# Altium project OpenIMU.PrjPcb
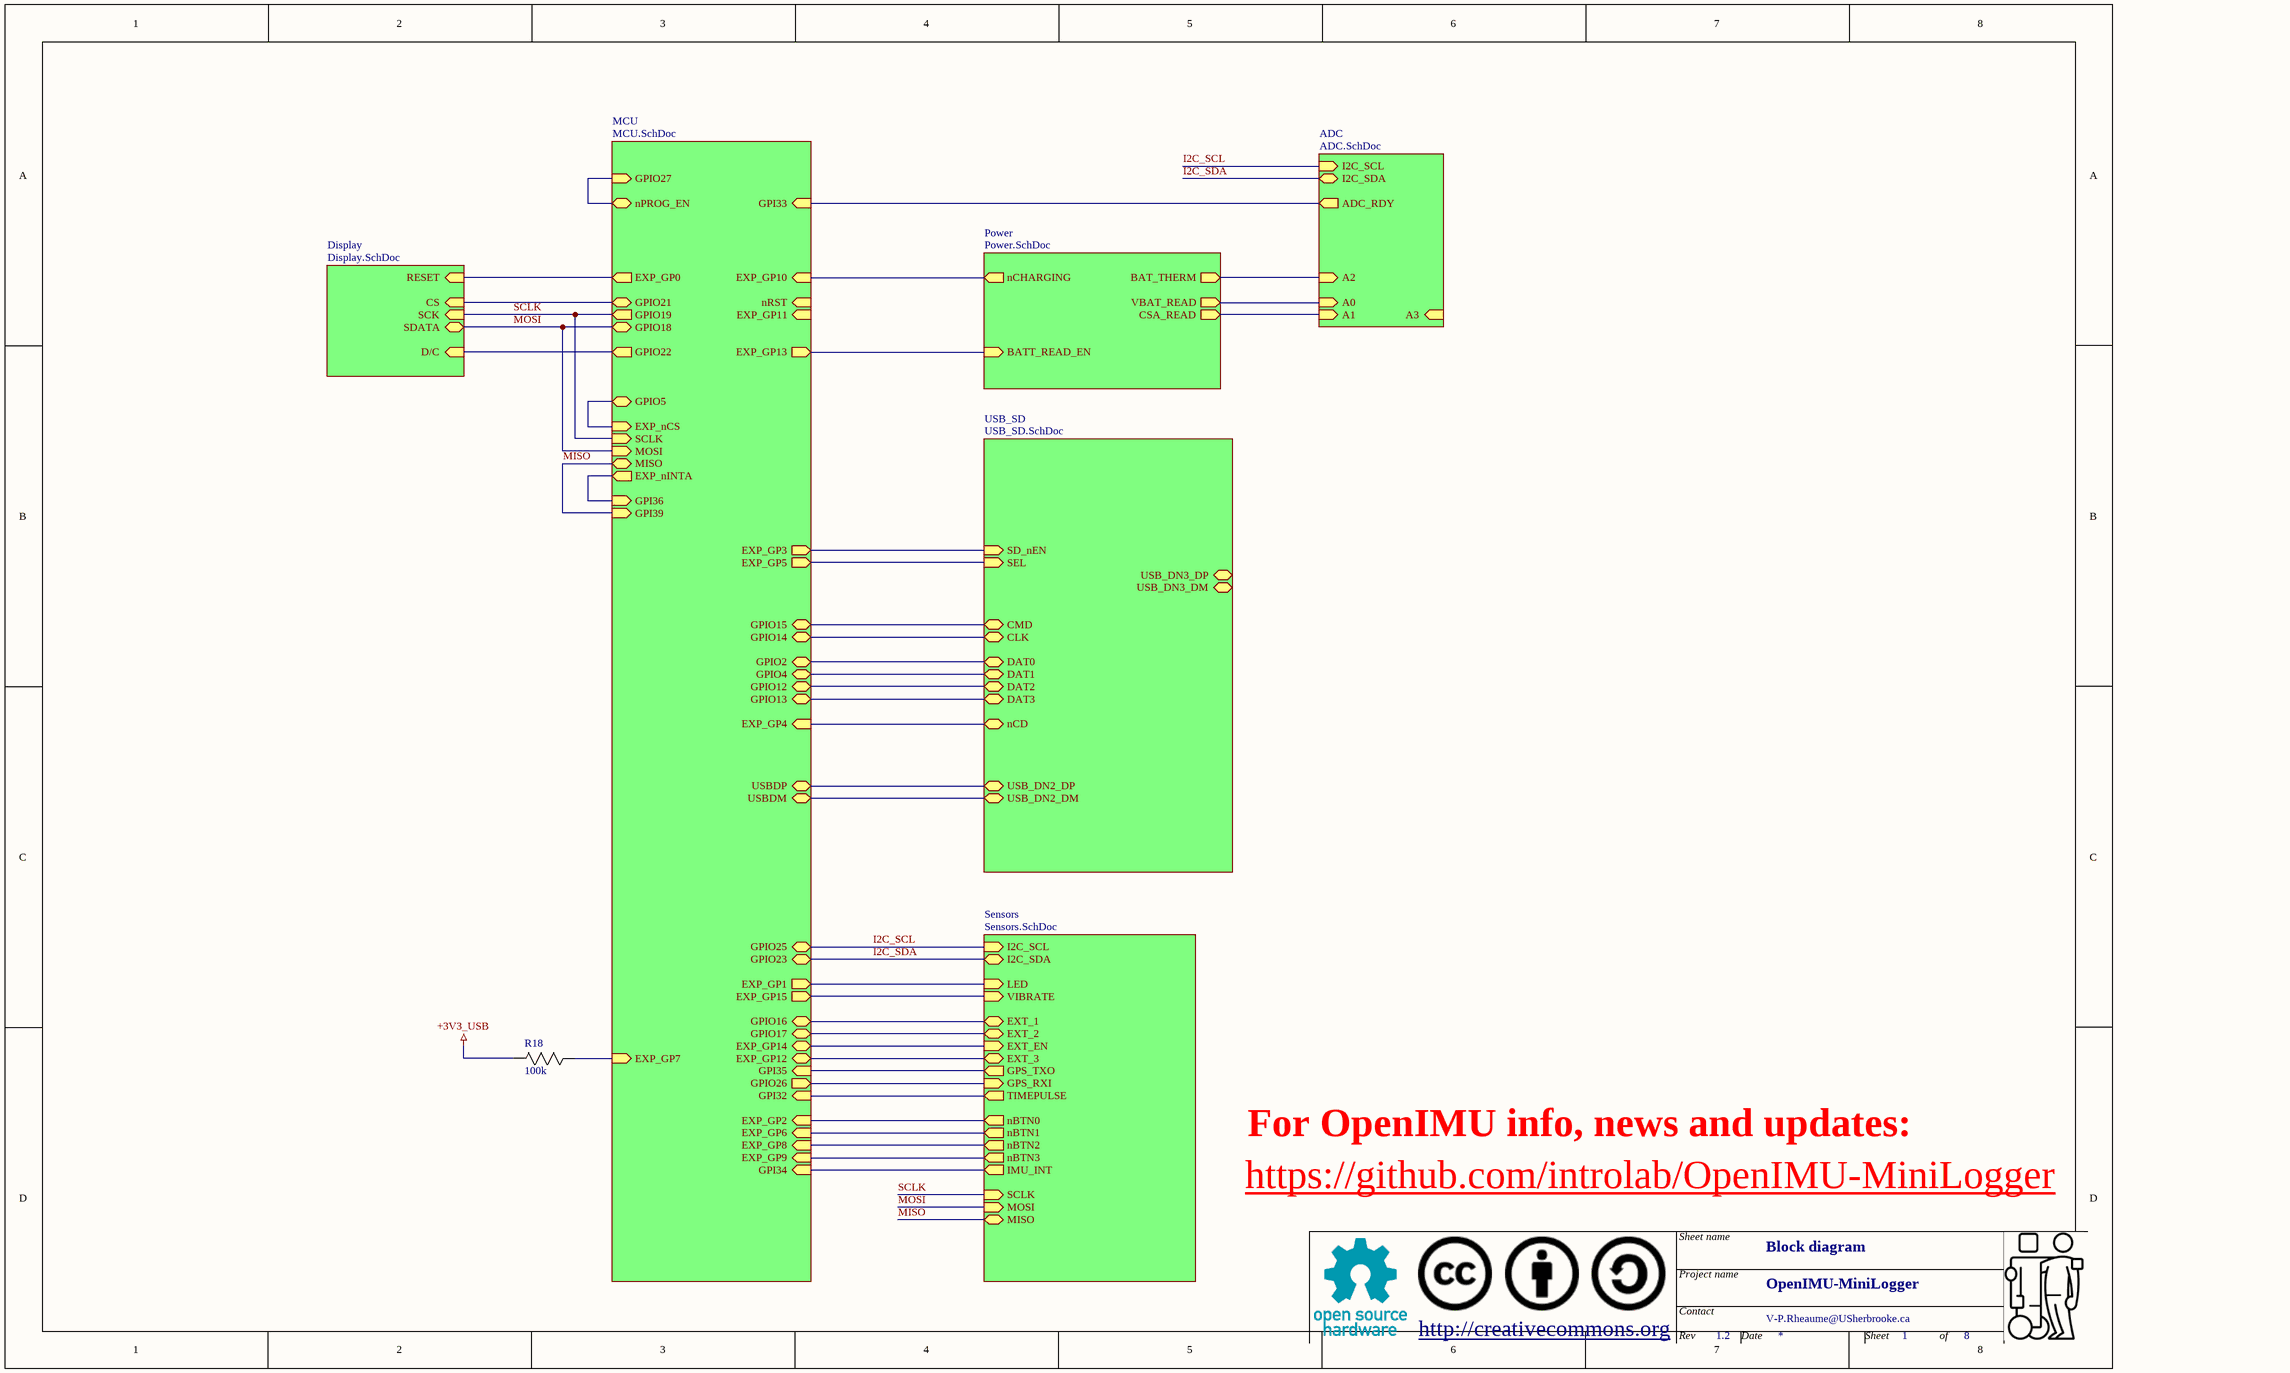
[diagram p0: TopLevel.SchDoc]
RevisionGlobal: 1.2; ProjectTitle: OpenIMU-MiniLogger; DrawnByGlobal: V-P.Rheaume@USherbrooke.ca
8 sheets, 117 parts. Net scope: hierarchical (ports join the sheet entries above them; power ports are global).
Board file: PCB1.PcbDoc
Sheets:
  TopLevel.SchDoc
    USB_SD = USB_SD.SchDoc
      SD_Share = SD_Share.SchDoc
    MCU = MCU.SchDoc
    Power = Power.SchDoc
    Sensors = Sensors.SchDoc
    Display = Display.SchDoc
    ADC = ADC.SchDoc

## Sheet TopLevel.SchDoc
size Tabloid; DrawnBy: V-P.Rheaume@USherbrooke.ca; Organization: Universite de Sherbrooke; Address1: L3, 12a Rodborough Rd; Address2: Frenchs Forest; Address3: NSW; Address4: Australia 2086; Revision: 0; SheetNumber: 1; SheetTotal: 8; SheetName: Block diagram

### Parts
R18  value 100k  [0402]  (hidden comment: Resistor)

### Sub-sheets
ADC = ADC.SchDoc: A2 (in), A3 (in), A1 (in), A0 (in), I2C_SCL (in), ADC_RDY (out), I2C_SDA (bidir)
Display = Display.SchDoc: SDATA (bidir), CS (in), RESET (in), SCK (in), D/C (in)
MCU = MCU.SchDoc: GPIO14 (bidir), GPIO13 (bidir), GPIO4 (bidir), USBDP (bidir), GPIO12 (bidir), USBDM (bidir), GPIO15 (bidir), GPIO2 (bidir), EXP_GP7 (in), EXP_GP3 (out), EXP_GP2 (in), EXP_GP1 (out), EXP_GP0 (out), EXP_GP6 (in), EXP_GP5 (out), EXP_GP4 (in), EXP_GP11 (in), EXP_GP9 (in), EXP_GP14 (bidir), EXP_GP8 (in), EXP_GP13 (out), EXP_GP15 (out), EXP_GP12 (bidir), EXP_GP10 (in), GPIO5 (bidir), GPIO16 (bidir), GPIO17 (bidir), GPIO18 (bidir), GPIO19 (out), GPIO22 (out), GPIO21 (bidir), GPI35 (in), GPIO27 (in), GPIO26 (out), GPIO23 (bidir), GPIO25 (bidir), nRST (in), GPI39 (in), GPI36 (in), GPI34 (in), MOSI (in), EXP_nCS (in), MISO (bidir), SCLK (in), EXP_nINTA (out), GPI33 (in), GPI32 (in), nPROG_EN (bidir)
Power = Power.SchDoc: CSA_READ (out), VBAT_READ (out), BATT_READ_EN (in), BAT_THERM (out), nCHARGING (out)
Sensors = Sensors.SchDoc: TIMEPULSE (out), LED (in), nBTN2 (out), VIBRATE (in), nBTN1 (out), IMU_INT (out), I2C_SDA (bidir), I2C_SCL (in), GPS_RXI (in), GPS_TXO (out), EXT_1 (bidir), EXT_2 (bidir), EXT_EN (in), nBTN3 (out), nBTN0 (out), MISO (bidir), MOSI (in), EXT_3 (bidir), SCLK (in)
USB_SD = USB_SD.SchDoc: SEL (in), CMD (bidir), CLK (bidir), DAT1 (bidir), nCD (bidir), DAT2 (bidir), DAT0 (bidir), USB_DN3_DP (bidir), USB_DN3_DM (bidir), DAT3 (bidir), USB_DN2_DM (bidir), USB_DN2_DP (bidir), SD_nEN (in)

### Nets
+3V3_USB: R18.2
I2C_SCL: sheet MCU/GPIO25, sheet Sensors/I2C_SCL, sheet ADC/I2C_SCL
I2C_SDA: sheet MCU/GPIO23, sheet Sensors/I2C_SDA, sheet ADC/I2C_SDA
MISO: sheet MCU/GPI39, sheet MCU/MISO, sheet Sensors/MISO
MOSI: sheet MCU/GPIO18, sheet MCU/MOSI, sheet Sensors/MOSI, sheet Display/SDATA
SCLK: sheet MCU/GPIO19, sheet MCU/SCLK, sheet Sensors/SCLK, sheet Display/SCK
NetC20_2: sheet Power/VBAT_READ, sheet ADC/A0
NetC23_2: sheet Power/BAT_THERM, sheet ADC/A2
NetC43_2: sheet MCU/EXP_GP13, sheet Power/BATT_READ_EN
NetD2_A: sheet MCU/EXP_GP1, sheet Sensors/LED
NetD3_A: sheet USB_SD/nCD, sheet MCU/EXP_GP4
NetD5_A: sheet MCU/EXP_GP10, sheet Power/nCHARGING
NetP6_6: sheet MCU/GPIO21, sheet Display/CS
NetP6_7: sheet MCU/GPIO22, sheet Display/D/C
NetP6_8: sheet MCU/EXP_GP0, sheet Display/RESET
NetQ1_G: sheet MCU/EXP_GP15, sheet Sensors/VIBRATE
NetQ2_G: sheet USB_SD/SD_nEN, sheet MCU/EXP_GP3
NetQ4_G: sheet USB_SD/SEL, sheet MCU/EXP_GP5
NetQ15_G: sheet MCU/EXP_GP14, sheet Sensors/EXT_EN
NetR2_1: sheet MCU/GPIO26, sheet Sensors/GPS_RXI
NetR3_1: sheet MCU/GPI35, sheet Sensors/GPS_TXO
NetR18_1: R18.1 ; sheet MCU/EXP_GP7
NetR26_1: sheet MCU/GPIO27, sheet MCU/nPROG_EN
NetR32_2: sheet MCU/GPIO17, sheet Sensors/EXT_2
NetR34_2: sheet MCU/GPIO16, sheet Sensors/EXT_1
NetR41_2: sheet MCU/EXP_GP12, sheet Sensors/EXT_3
NetSW2_1: sheet MCU/EXP_GP8, sheet Sensors/nBTN2
NetSW3_1: sheet MCU/EXP_GP9, sheet Sensors/nBTN3
NetSW4_1: sheet MCU/EXP_GP6, sheet Sensors/nBTN1
NetSW5_1: sheet MCU/EXP_GP2, sheet Sensors/nBTN0
NetU3_12: sheet USB_SD/DAT1, sheet MCU/GPIO4
NetU3_13: sheet USB_SD/DAT0, sheet MCU/GPIO2
NetU3_14: sheet USB_SD/CLK, sheet MCU/GPIO14
NetU3_16: sheet USB_SD/CMD, sheet MCU/GPIO15
NetU3_17: sheet USB_SD/DAT3, sheet MCU/GPIO13
NetU3_18: sheet USB_SD/DAT2, sheet MCU/GPIO12
NetU4_4: sheet MCU/GPI36, sheet MCU/EXP_nINTA
NetU4_6: sheet MCU/GPI34, sheet Sensors/IMU_INT
NetU4_8: sheet MCU/GPI32, sheet Sensors/TIMEPULSE
NetU4_9: sheet MCU/GPI33, sheet ADC/ADC_RDY
NetU4_29: sheet MCU/GPIO5, sheet MCU/EXP_nCS
NetU6_1: sheet USB_SD/USB_DN2_DM, sheet MCU/USBDM
NetU6_2: sheet USB_SD/USB_DN2_DP, sheet MCU/USBDP
NetU13_5: sheet Power/CSA_READ, sheet ADC/A1

### Notes on the sheet
- For OpenIMU info, news and updates:
- https://github.com/introlab/OpenIMU-MiniLogger
- Sheet name
- http://creativecommons.org
- Project name
- Contact
- Rev
- Date
- Sheet
- of

### Library data of the parts
R18 = Resistor: Mfg: Yageo; Mfg_PN: RC0402JR-07100KL; HelpURL: *; NI: *; Supplier1: Digikey; Supplier1_PN: 311-100KJRCT-ND; Type: *; Rating: *; Tolerance: *

## Sheet USB_SD.SchDoc
size Tabloid; DrawnBy: V-P.Rheaume@USherbrooke.ca; Organization: Universite de Sherbrooke; Address1: L3, 12a Rodborough Rd; Address2: Frenchs Forest; Address3: NSW; Address4: Australia 2086; Revision: 0; SheetNumber: 4; SheetTotal: 8; SheetName: USB hub
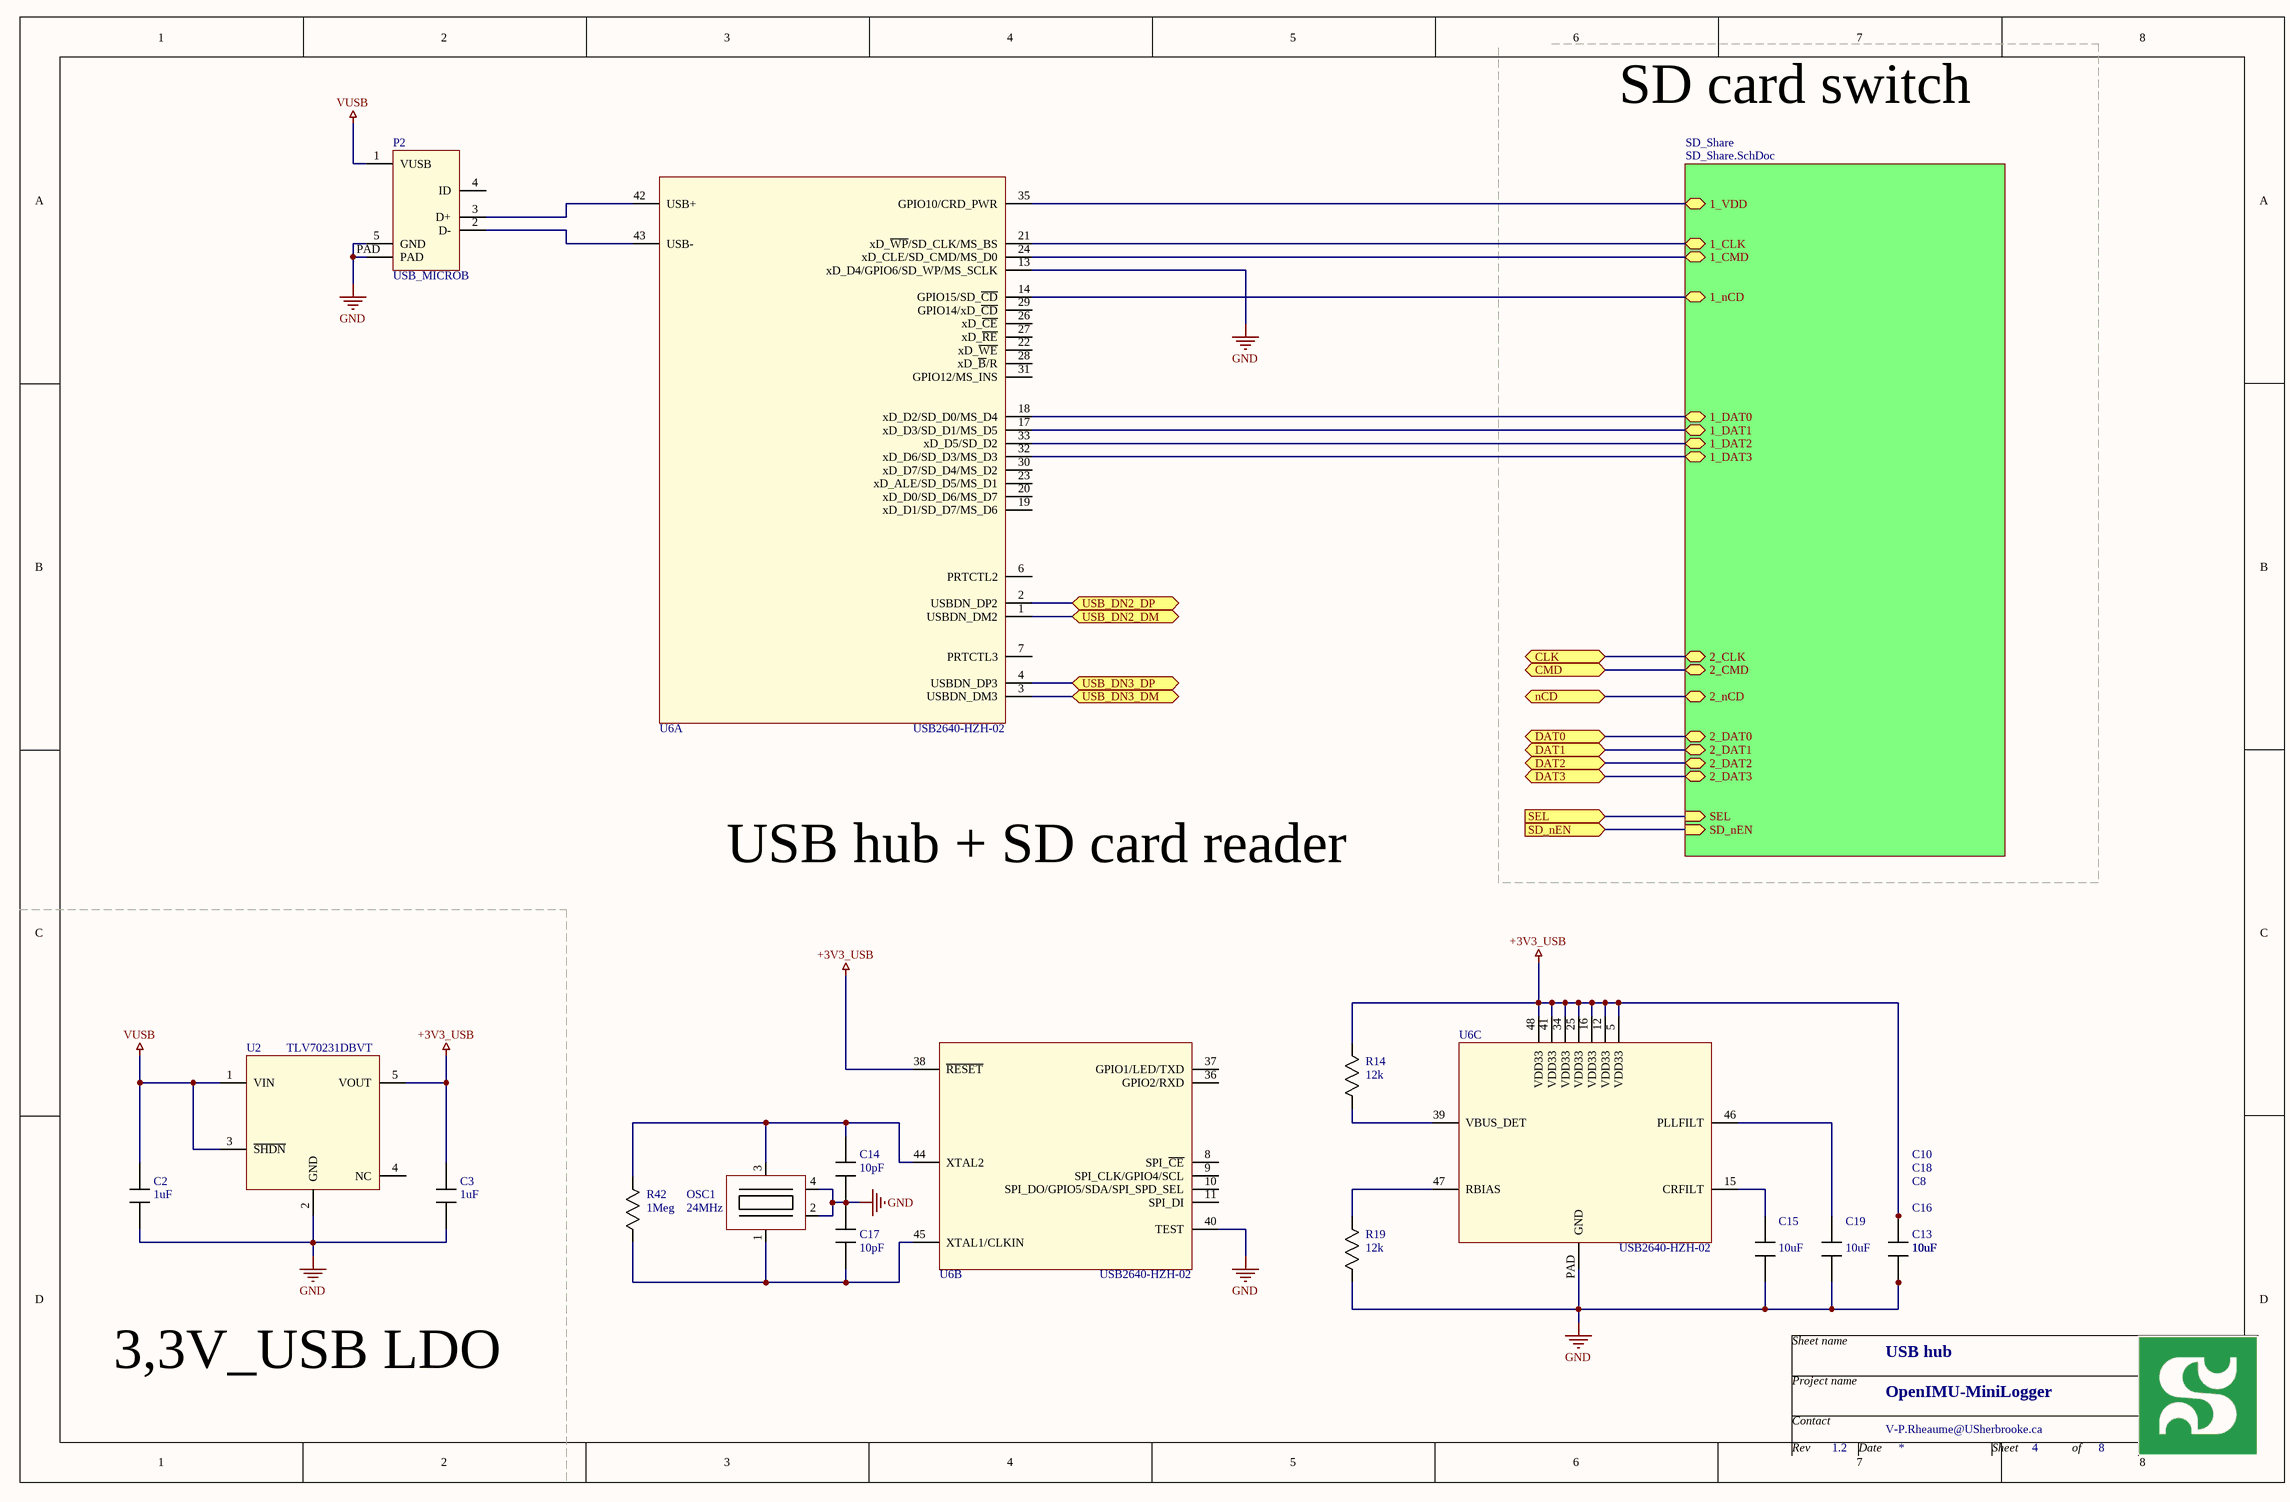
[diagram p1: USB_SD.SchDoc]

### Parts
C2  value 1uF  [0603]  (hidden comment: Capacitor)
C3  value 1uF  [0603]  (hidden comment: Capacitor)
C8  value 10uF  [0603]  (hidden comment: Capacitor)
C10  value 10uF  [0603]  (hidden comment: Capacitor)
C13  value 10uF  [0603]  (hidden comment: Capacitor)
C14  value 10pF  [0402]  (hidden comment: Capacitor)
C15  value 10uF  [0603]  (hidden comment: Capacitor)
C16  value 10uF  [0603]  (hidden comment: Capacitor)
C17  value 10pF  [0402]  (hidden comment: Capacitor)
C18  value 10uF  [0603]  (hidden comment: Capacitor)
C19  value 10uF  [0603]  (hidden comment: Capacitor)
OSC1  value 24MHz  [XTAL_ABM10]  (hidden comment: Crystal_4)
P2  USB_MICROB  [USB_MICROB]
R14  value 12k  [0402]  (hidden comment: Resistor)
R19  value 12k  [0402]  (hidden comment: Resistor)
R42  value 1Meg  [0603]  (hidden comment: Resistor)
U2  Mfg_PN: TLV70231DBVT  [SOT23_5]  (hidden comment: AP2112K-3.3TRG1)
U6  USB2640-HZH-02  [QFN48]  (parts A,B,C of 3)

### Sub-sheets
SD_Share = SD_Share.SchDoc: 2_DAT0 (bidir), 2_DAT1 (bidir), 1_nCD (bidir), 1_VDD (bidir), 2_nCD (bidir), SEL (in), 2_DAT3 (bidir), 1_DAT2 (bidir), 1_DAT1 (bidir), 1_CLK (bidir), 1_CMD (bidir), 2_CMD (bidir), 2_DAT2 (bidir), 1_DAT0 (bidir), 2_CLK (bidir), 1_DAT3 (bidir), SD_nEN (in)

### Ports
CLK (bidir), CMD (bidir), DAT0 (bidir), DAT1 (bidir), DAT2 (bidir), DAT3 (bidir), nCD (bidir), SD_nEN (in), SEL (in), USB_DN2_DM (bidir), USB_DN2_DP (bidir), USB_DN3_DM (bidir), USB_DN3_DP (bidir)

### Nets
+3V3_USB: C3.1 C8.1 C10.1 C13.1 C16.1 C18.1 R14.1 U2.5(VOUT) U6.5(VDD33) U6.12(VDD33) U6.16(VDD33) U6.25(VDD33) U6.34(VDD33) U6.38(~{RESET}) U6.41(VDD33) U6.48(VDD33)
GND: C2.2 C3.2 C8.2 C10.2 C13.2 C14.2 C15.2 C16.2 C17.1 C18.2 C19.2 OSC1.2 OSC1.4 P2.5(GND) P2.PAD R19.2 U2.2(GND) U6.13(xD_D4/GPIO6/SD_WP/MS_SCLK) U6.40(TEST) U6.PAD(GND)
VUSB: C2.1 P2.1(VUSB) U2.1(VIN) U2.3(~{SHDN})
1_VDD: U6.35(GPIO10/CRD_PWR) ; sheet SD_Share/1_VDD
NetC14_1: C14.1 OSC1.3 R42.1 U6.44(XTAL2)
NetC15_1: C15.1 U6.15(CRFILT)
NetC17_2: C17.2 OSC1.1 R42.2 U6.45(XTAL1/CLKIN)
NetC19_1: C19.1 U6.46(PLLFILT)
NetD3_A: port nCD, sheet SD_Share/2_nCD
NetD4_A: U6.14(GPIO15/SD_~{CD}) ; sheet SD_Share/1_nCD
NetP2_2: P2.2(D-) U6.43(USB-)
NetP2_3: P2.3(D+) U6.42(USB+)
NetQ2_G: port SD_nEN, sheet SD_Share/SD_nEN
NetQ4_G: port SEL, sheet SD_Share/SEL
NetR14_2: R14.2 U6.39(VBUS_DET)
NetR19_1: R19.1 U6.47(RBIAS)
NetU3_1: U6.33(xD_D5/SD_D2) ; sheet SD_Share/1_DAT2
NetU3_12: port DAT1, sheet SD_Share/2_DAT1
NetU3_13: port DAT0, sheet SD_Share/2_DAT0
NetU3_14: port CLK, sheet SD_Share/2_CLK
NetU3_16: port CMD, sheet SD_Share/2_CMD
NetU3_17: port DAT3, sheet SD_Share/2_DAT3
NetU3_18: port DAT2, sheet SD_Share/2_DAT2
NetU3_19: U6.17(xD_D3/SD_D1/MS_D5) ; sheet SD_Share/1_DAT1
NetU3_20: U6.18(xD_D2/SD_D0/MS_D4) ; sheet SD_Share/1_DAT0
NetU3_21: U6.21(xD_~{WP}/SD_CLK/MS_BS) ; sheet SD_Share/1_CLK
NetU3_23: U6.24(xD_CLE/SD_CMD/MS_D0) ; sheet SD_Share/1_CMD
NetU3_24: U6.32(xD_D6/SD_D3/MS_D3) ; sheet SD_Share/1_DAT3
NetU6_1: U6.1(USBDN_DM2) ; port USB_DN2_DM
NetU6_2: U6.2(USBDN_DP2) ; port USB_DN2_DP
NetU6_3: U6.3(USBDN_DM3) ; port USB_DN3_DM
NetU6_4: U6.4(USBDN_DP3) ; port USB_DN3_DP

Not connected (* = marked no-connect by the designer): P2 4(ID); U2 4(NC); U6 6(PRTCTL2) 7(PRTCTL3) 8(SPI_~{CE}) 9(SPI_CLK/GPIO4/SCL) 10(SPI_DO/GPIO5/SDA/SPI_SPD_SEL) 11(SPI_DI) 19(xD_D1/SD_D7/MS_D6) 20(xD_D0/SD_D6/MS_D7) 22(xD_~{WE}) 23(xD_ALE/SD_D5/MS_D1) 26(xD_~{CE}) 27(xD_~{RE}) 28(xD_~{B}/R) 29(GPIO14/xD_~{CD}) 30(xD_D7/SD_D4/MS_D2) 31(GPIO12/MS_INS) 36(GPIO2/RXD) 37(GPIO1/LED/TXD)

### Notes on the sheet
- SD card switch
- USB hub + SD card reader
- 3,3V_USB LDO
- Sheet name
- Project name
- Contact
- Rev
- Date
- Sheet
- of

### Library data of the parts
C2 C3 = Capacitor: Mfg: Samsung; Mfg_PN: CL10A105KP8NNNC; HelpURL: *; NI: *; Supplier1: Digikey; Supplier1_PN: 1276-1182-1-ND; Tolerance: *; Type: *; Rating: *
C8 C10 C13 C15 C16 C18 C19 = Capacitor: Mfg: Murata; Mfg_PN: GRM188R60J106ME47D; HelpURL: *; NI: *; Supplier1: Digikey; Supplier1_PN: 490-3896-1-ND; Tolerance: *; Type: *; Rating: *
C14 C17 = Capacitor: Mfg: Wurth; Mfg_PN: 885012005007; HelpURL: *; NI: *; Supplier1: Digikey; Supplier1_PN: 732-7425-1-ND; Tolerance: *; Type: *; Rating: *
OSC1 = Crystal_4: Crystal; Mfg: Abracon; Mfg_PN: ABM10-24.000MHZ-E20-T; HelpURL: *; NI: *; Rating: *; Supplier1: Digikey; Supplier1_PN: 535-9093-1-ND; Tolerance: *; Type: *
P2 = USB_MICROB: Micro-B USB connector; Mfg: Amphenol; Mfg_PN: 10118193-0001LF; HelpURL: http://portal.fciconnect.com/Comergent//fci/drawing/10118193.pdf; NI: *; Rating: *; Supplier1: Digikey; Supplier1_PN: 609-4616-1-ND; Tolerance: *; Type: *; Value: *
R14 R19 = Resistor: Mfg: Yageo; Mfg_PN: RC0402JR-0712KL; HelpURL: *; NI: *; Supplier1: Digikey; Supplier1_PN: 311-12KJRCT-ND; Type: *; Rating: *; Tolerance: *
R42 = Resistor: Mfg: Stackpole; Mfg_PN: RMCF0603JG1M00; HelpURL: *; NI: *; Supplier1: Digikey; Supplier1_PN: RMCF0603JG1M00CT-ND; Type: *; Rating: *; Tolerance: *
U2 = AP2112K-3.3TRG1: Linear voltage regulator; Mfg: TI; HelpURL: *; NI: *; Supplier1: Digikey; Supplier1_PN: 296-27894-1-ND; Type: *
U6 = USB2640-HZH-02: USB2 hub and card reader; Mfg: Microchip; HelpURL: *; NI: *; Rating: *; Supplier1: Digikey; Supplier1_PN: USB2640-HZH-02-ND; Tolerance: *; Type: *; Value: *; Mfg_PN: USB2640-HZH-02

## Sheet SD_Share.SchDoc
size Tabloid; DrawnBy: V-P.Rheaume@USherbrooke.ca; Organization: Universite de Sherbrooke; Address1: L3, 12a Rodborough Rd; Address2: Frenchs Forest; Address3: NSW; Address4: Australia 2086; Revision: 0; SheetNumber: 5; SheetTotal: 8; SheetName: SD Card Sharing
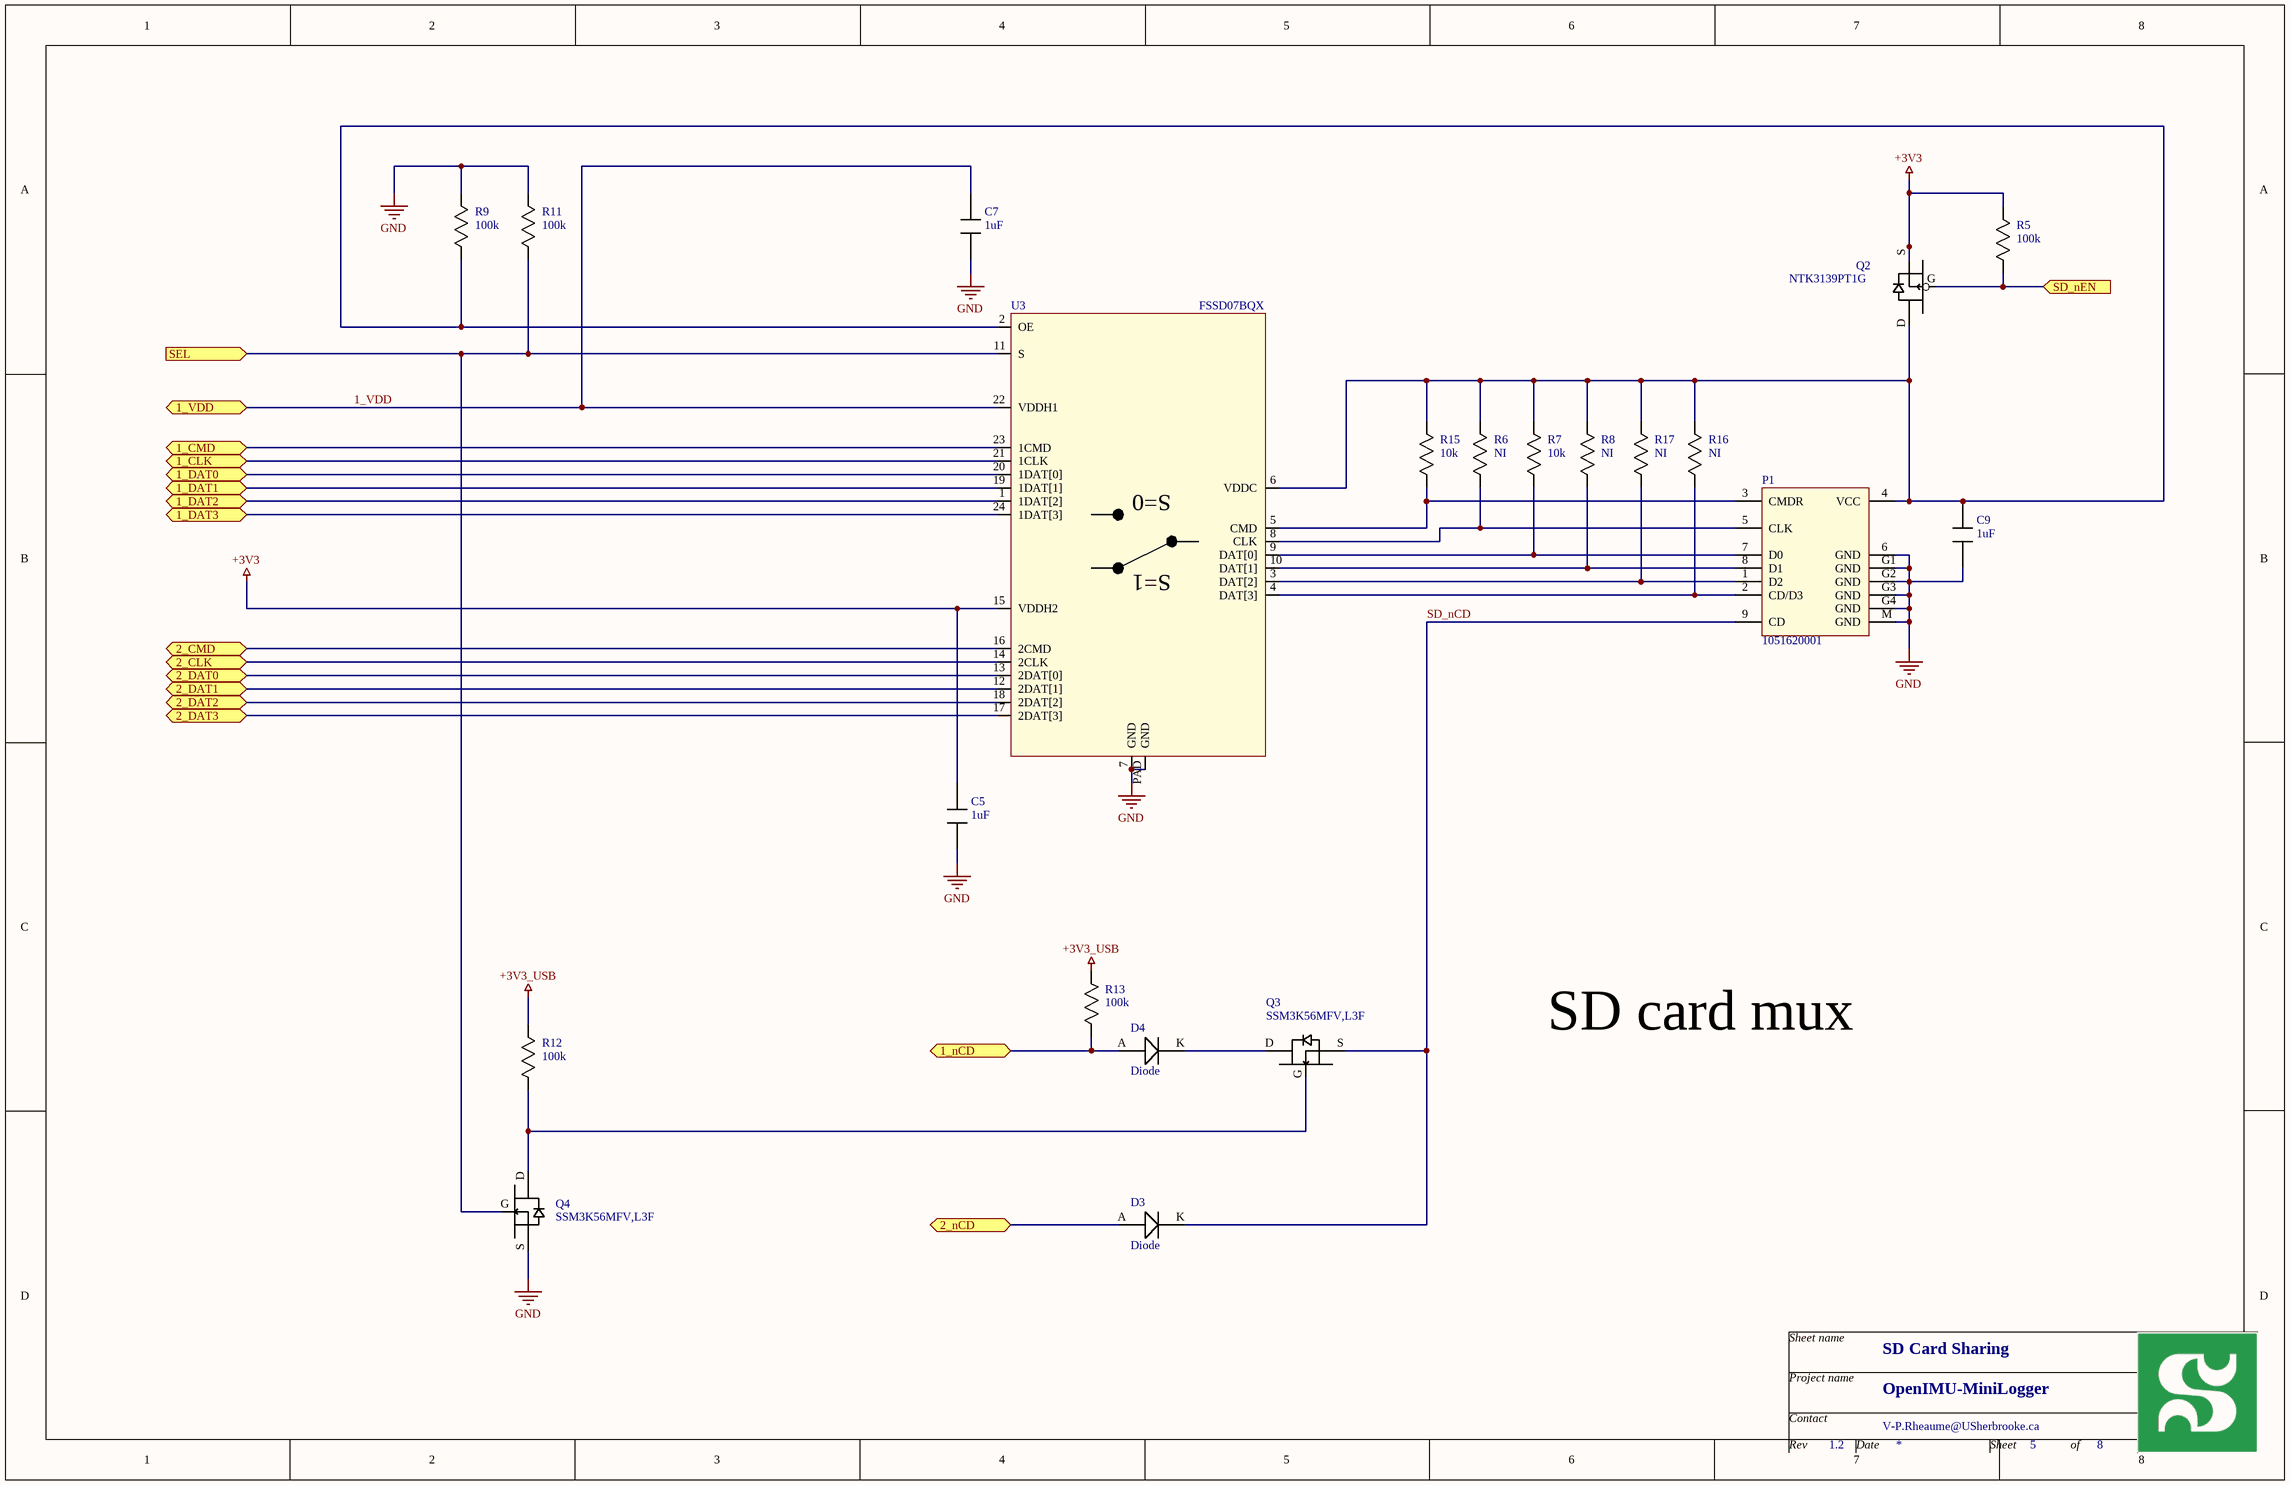
[diagram p2: SD_Share.SchDoc]

### Parts
C5  value 1uF  [0603]  (hidden comment: Capacitor)
C7  value 1uF  [0603]  (hidden comment: Capacitor)
C9  value 1uF  [0603]  (hidden comment: Capacitor)
D3  Diode  [DIODE_SOD523]
D4  Diode  [DIODE_SOD523]
P1  Mfg_PN: 1051620001  [CONN_uSD_MOLEX_1051620001]  (hidden comment: CON_uSD_1051620001)
Q2  Mfg_PN: NTK3139PT1G  [SOT723]  (hidden comment: MOSFET_P_GDS)
Q3  Mfg_PN: SSM3K56MFV,L3F  [SOT723]  (hidden comment: MOSFET_N_GDS)
Q4  Mfg_PN: SSM3K56MFV,L3F  [SOT723]  (hidden comment: MOSFET_N_GDS)
R5  value 100k  [0402]  (hidden comment: Resistor)
R6  Resistor  [0402]  (value not drawn)
R7  value 10k  [0402]  (hidden comment: Resistor)
R8  Resistor  [0402]  (value not drawn)
R9  value 100k  [0402]  (hidden comment: Resistor)
R11  value 100k  [0402]  (hidden comment: Resistor)
R12  value 100k  [0402]  (hidden comment: Resistor)
R13  value 100k  [0402]  (hidden comment: Resistor)
R15  value 10k  [0402]  (hidden comment: Resistor)
R16  Resistor  [0402]  (value not drawn)
R17  Resistor  [0402]  (value not drawn)
U3  FSSD07BQX  [MLP24]

### Ports
1_CLK (bidir), 1_CMD (bidir), 1_DAT0 (bidir), 1_DAT1 (bidir), 1_DAT2 (bidir), 1_DAT3 (bidir), 1_nCD (bidir), 1_VDD (bidir), 2_CLK (bidir), 2_CMD (bidir), 2_DAT0 (bidir), 2_DAT1 (bidir), 2_DAT2 (bidir), 2_DAT3 (bidir), 2_nCD (bidir), SD_nEN (in), SEL (in)

### Nets
+3V3: C5.1 Q2.S R5.1 U3.15(VDDH2)
+3V3_USB: R12.1 R13.1
GND: C5.2 C7.2 C9.2 P1.6(GND) P1.G1(GND) P1.G2(GND) P1.G3(GND) P1.G4(GND) P1.M(GND) Q4.S R9.1 R11.1 U3.7(GND) U3.PAD(GND)
1_VDD: C7.1 U3.22(VDDH1) ; port 1_VDD
SD_nCD: D3.K P1.9(CD) Q3.S
NetC9_1: C9.1 P1.4(VCC) Q2.D R6.1 R7.1 R8.1 R9.2 R15.1 R16.1 R17.1 U3.2(OE) U3.6(VDDC)
NetD3_A: D3.A ; port 2_nCD
NetD4_A: D4.A R13.2 ; port 1_nCD
NetD4_K: D4.K Q3.D
NetP1_1: P1.1(D2) R17.2 U3.3(DAT[2])
NetP1_2: P1.2(CD/D3) R16.2 U3.4(DAT[3])
NetP1_3: P1.3(CMDR) R15.2 U3.5(CMD)
NetP1_5: P1.5(CLK) R6.2 U3.8(CLK)
NetP1_7: P1.7(D0) R7.2 U3.9(DAT[0])
NetP1_8: P1.8(D1) R8.2 U3.10(DAT[1])
NetQ2_G: Q2.G R5.2 ; port SD_nEN
NetQ3_G: Q3.G Q4.D R12.2
NetQ4_G: Q4.G R11.2 U3.11(S) ; port SEL
NetU3_1: U3.1(1DAT[2]) ; port 1_DAT2
NetU3_12: U3.12(2DAT[1]) ; port 2_DAT1
NetU3_13: U3.13(2DAT[0]) ; port 2_DAT0
NetU3_14: U3.14(2CLK) ; port 2_CLK
NetU3_16: U3.16(2CMD) ; port 2_CMD
NetU3_17: U3.17(2DAT[3]) ; port 2_DAT3
NetU3_18: U3.18(2DAT[2]) ; port 2_DAT2
NetU3_19: U3.19(1DAT[1]) ; port 1_DAT1
NetU3_20: U3.20(1DAT[0]) ; port 1_DAT0
NetU3_21: U3.21(1CLK) ; port 1_CLK
NetU3_23: U3.23(1CMD) ; port 1_CMD
NetU3_24: U3.24(1DAT[3]) ; port 1_DAT3

### Notes on the sheet
- SD card mux
- Sheet name
- Project name
- Contact
- Rev
- Date
- Sheet
- of
- (in symbol FSSD07BQX) S=0; S=1

### Library data of the parts
C5 C7 C9 = Capacitor: Mfg: Samsung; Mfg_PN: CL10A105KP8NNNC; HelpURL: *; NI: *; Supplier1: Digikey; Supplier1_PN: 1276-1182-1-ND; Tolerance: *; Type: *; Rating: *
D3 D4 = Diode: Mfg: MCC; Mfg_PN: 1N4148X-TP; HelpURL: *; NI: *; Supplier1: Digikey; Supplier1_PN: 1N4148XTPMSCT-ND; Tolerance: *; Type: *; Rating: *; Value: *
P1 = CON_uSD_1051620001: Micro-SD card slot; Mfg: Molex; HelpURL: *; NI: *; Rating: *; Supplier1: Digikey; Supplier1_PN: WM14405CT-ND; Tolerance: *; Type: uSD; Value: *
Q2 = MOSFET_P_GDS: PMOS; Mfg: OnSemi; HelpURL: *; NI: *; Rating: *; Supplier1: Digikey; Supplier1_PN: NTK3139PT1GOSCT-ND; Tolerance: *; Type: *; Value: *
Q3 Q4 = MOSFET_N_GDS: NMOS; Mfg: Toshiba; HelpURL: *; NI: *; Rating: *; Supplier1: Digikey; Supplier1_PN: SSM3K56MFVL3FCT-ND; Tolerance: *; Type: *; Value: *
R5 R9 R11-R13 = Resistor: Mfg: Yageo; Mfg_PN: RC0402JR-07100KL; HelpURL: *; NI: *; Supplier1: Digikey; Supplier1_PN: 311-100KJRCT-ND; Type: *; Rating: *; Tolerance: *
R6 R8 R16 R17 = Resistor: Mfg: Yageo; Mfg_PN: RC0402FR-0710KL; Value: 10k; HelpURL: *; NI: NI; Supplier1: Digikey; Supplier1_PN: 311-10.0KLRCT-ND; Type: *; Rating: *; Tolerance: *
R7 R15 = Resistor: Mfg: Yageo; Mfg_PN: RC0402FR-0710KL; HelpURL: *; NI: *; Supplier1: Digikey; Supplier1_PN: 311-10.0KLRCT-ND; Type: *; Rating: *; Tolerance: *
U3 = FSSD07BQX: SD Card Host multiplexer; Mfg: OnSemi; HelpURL: *; Mfg_PN: FSSD07BQX; NI: *; Supplier1: Digikey; Supplier1_PN: FSSD07BQXCT-ND; Type: *

## Sheet MCU.SchDoc
size Tabloid; DrawnBy: V-P.Rheaume@USherbrooke.ca; Organization: Universite de Sherbrooke; Address1: L3, 12a Rodborough Rd; Address2: Frenchs Forest; Address3: NSW; Address4: Australia 2086; Revision: 0; SheetNumber: 3; SheetTotal: 8; SheetName: Microcontroller
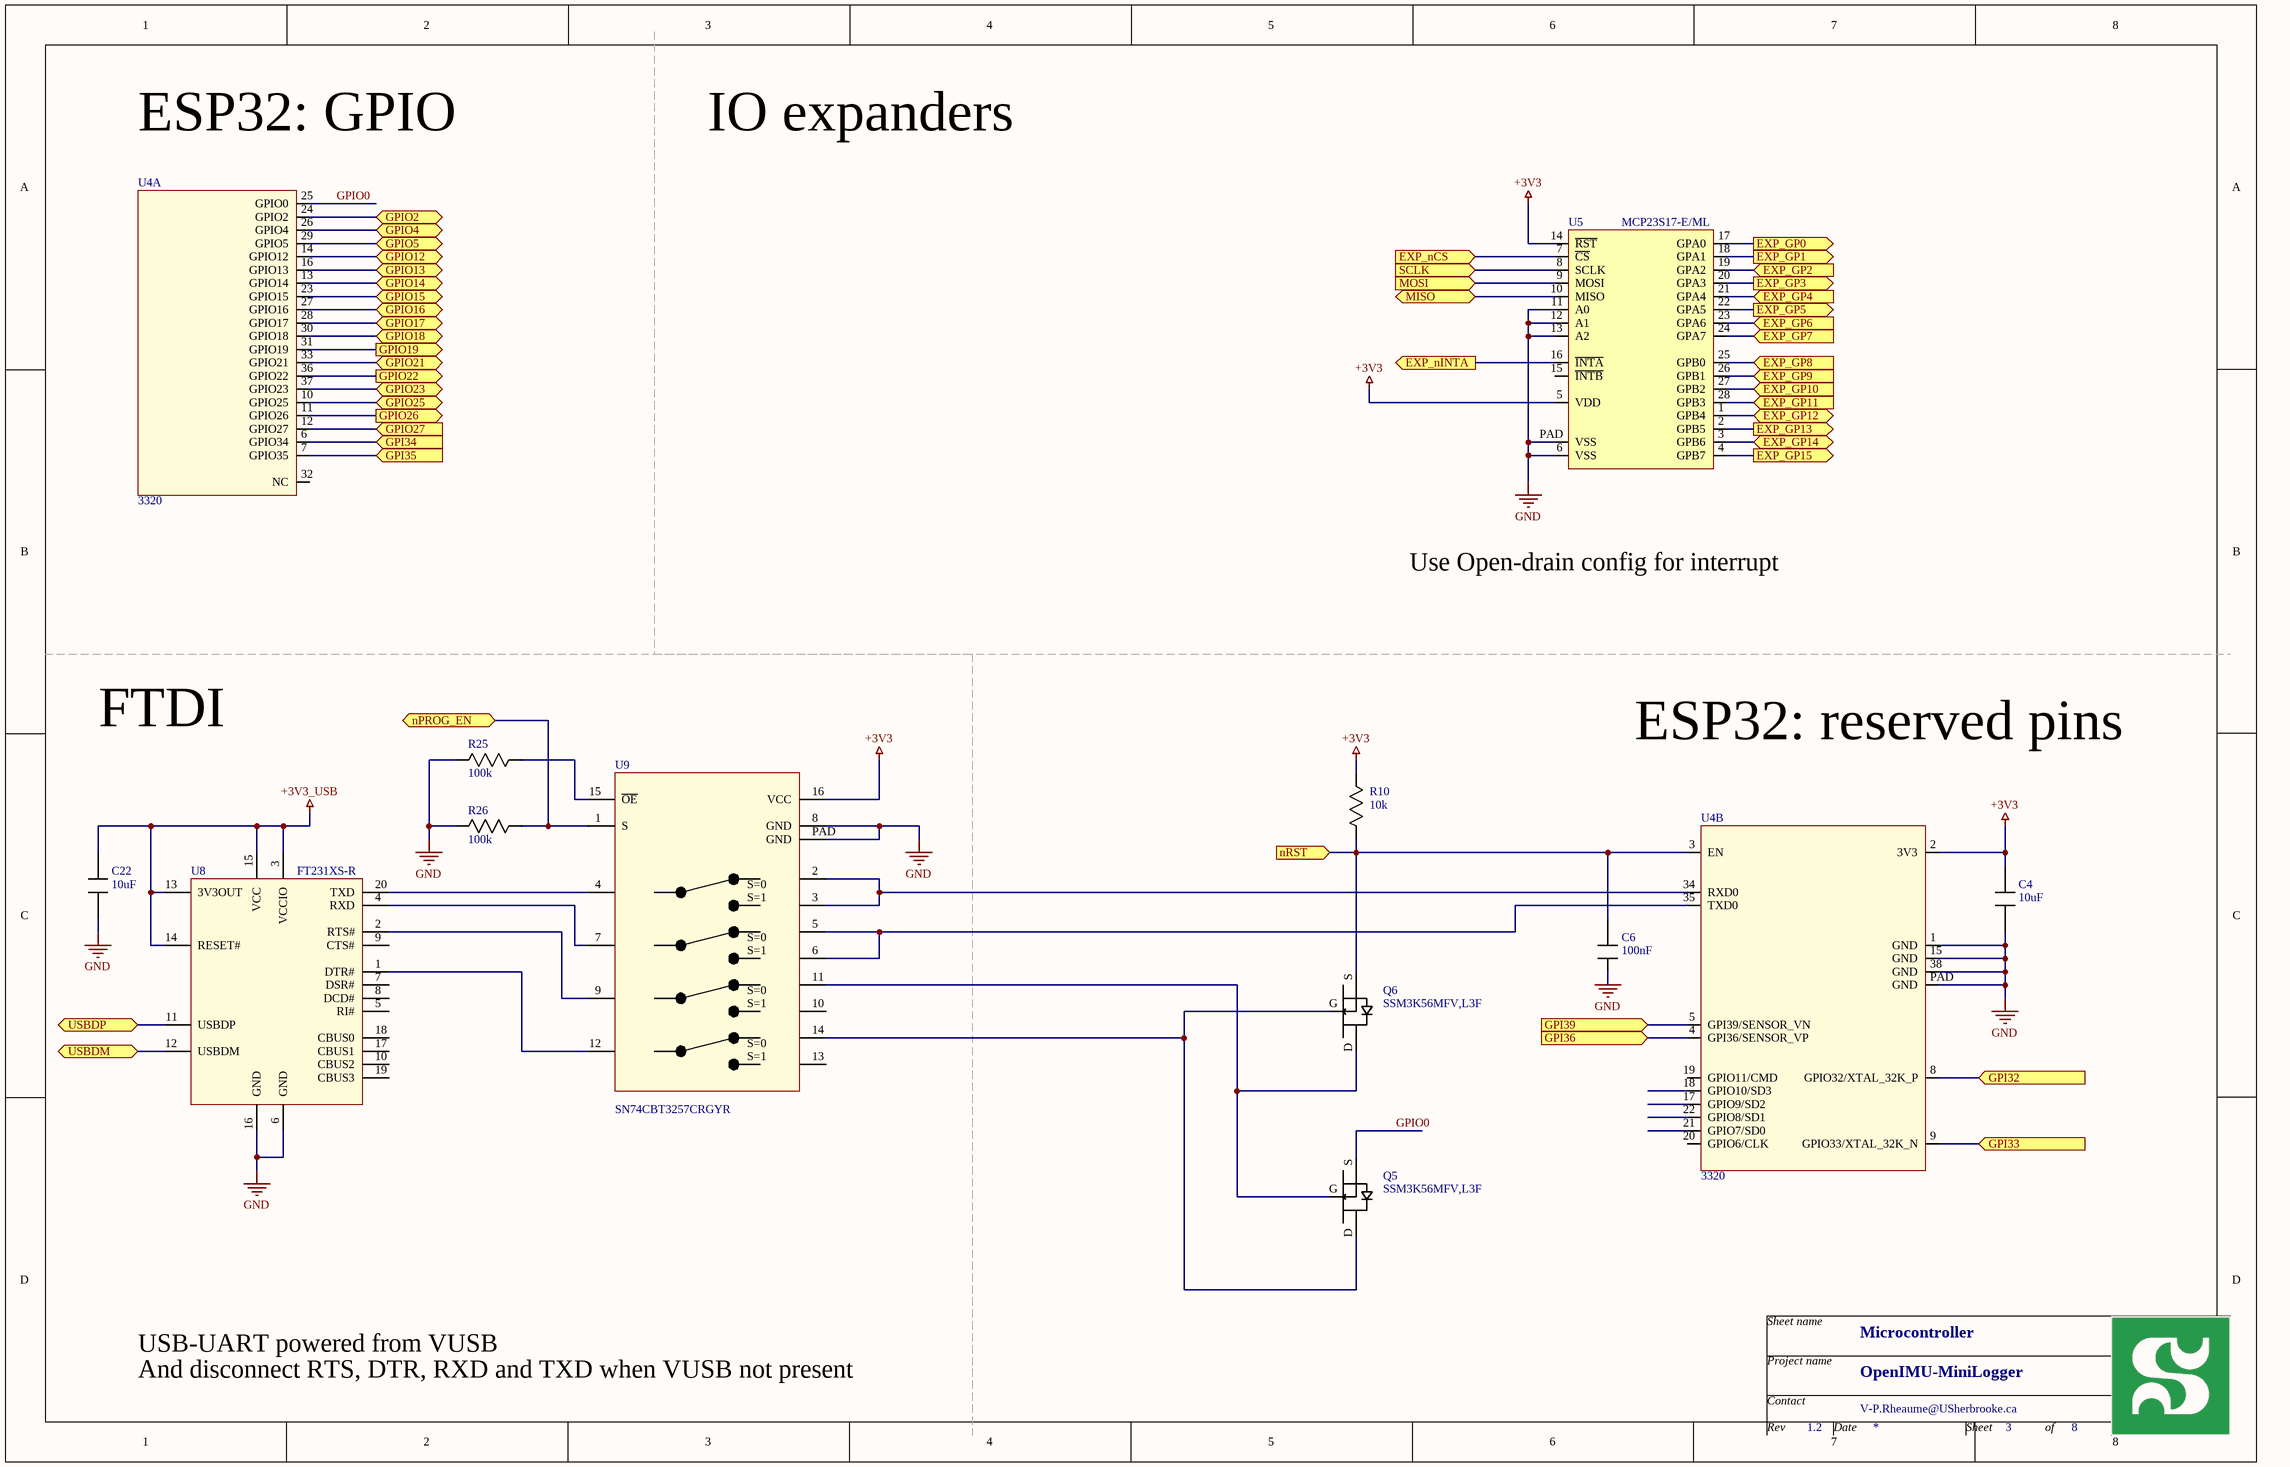
[diagram p3: MCU.SchDoc]

### Parts
C4  value 10uF  [0603]  (hidden comment: Capacitor)
C6  value 100nF  [0603]  (hidden comment: Capacitor)
C22  value 10uF  [0603]  (hidden comment: Capacitor)
Q5  Mfg_PN: SSM3K56MFV,L3F  [SOT723]  (hidden comment: MOSFET_N_GDS)
Q6  Mfg_PN: SSM3K56MFV,L3F  [SOT723]  (hidden comment: MOSFET_N_GDS)
R10  value 10k  [0402]  (hidden comment: Resistor)
R25  value 100k  [0402]  (hidden comment: Resistor)
R26  value 100k  [0402]  (hidden comment: Resistor)
U4  Mfg_PN: 3320  [ESP-WROOM-32]  (hidden comment: ESP-WROOM-32)  (parts A,B of 2)
U5  MCP23S17-E/ML  [QFN28-S]
U8  FT231XS-R  [SSOP20]
U9  SN74CBT3257CRGYR  [QFN16_TI_RGYR]

### Ports
EXP_GP0 (out), EXP_GP1 (out), EXP_GP2 (in), EXP_GP3 (out), EXP_GP4 (in), EXP_GP5 (out), EXP_GP6 (in), EXP_GP7 (in), EXP_GP8 (in), EXP_GP9 (in), EXP_GP10 (in), EXP_GP11 (in), EXP_GP12 (bidir), EXP_GP13 (out), EXP_GP14 (bidir), EXP_GP15 (out), EXP_nCS (in), EXP_nINTA (out), GPI32 (in), GPI33 (in), GPI34 (in), GPI35 (in), GPI36 (in), GPI39 (in), GPIO2 (bidir), GPIO4 (bidir), GPIO5 (bidir), GPIO12 (bidir), GPIO13 (bidir), GPIO14 (bidir), GPIO15 (bidir), GPIO16 (bidir), GPIO17 (bidir), GPIO18 (bidir), GPIO19 (out), GPIO21 (bidir), GPIO22 (out), GPIO23 (bidir), GPIO25 (bidir), GPIO26 (out), GPIO27 (in), MISO (bidir), MOSI (in), nPROG_EN (bidir), nRST (in), SCLK (in), USBDM (bidir), USBDP (bidir)

### Nets
+3V3: C4.2 R10.1 U4.2(3V3) U5.5(VDD) U5.14(~{RST}) U9.16(VCC)
+3V3_USB: C22.2 U8.3(VCCIO) U8.13(3V3OUT) U8.14(RESET#) U8.15(VCC)
GND: C4.1 C6.2 C22.1 R25.2 R26.2 U4.1(GND) U4.15(GND) U4.38(GND) U4.PAD(GND) U5.6(VSS) U5.11(A0) U5.12(A1) U5.13(A2) U5.PAD(VSS) U8.6(GND) U8.16(GND) U9.8(GND) U9.PAD(GND)
GPIO0: Q5.S U4.25(GPIO0)
I2C_SCL: U4.10(GPIO25) ; port GPIO25
I2C_SDA: U4.37(GPIO23) ; port GPIO23
MISO: U4.5(GPI39/SENSOR_VN) U5.10(MISO) ; port GPI39, port MISO
MOSI: U4.30(GPIO18) U5.9(MOSI) ; port GPIO18, port MOSI
SCLK: U4.31(GPIO19) U5.8(SCLK) ; port GPIO19, port SCLK
NetC6_1: C6.1 Q6.S R10.2 U4.3(EN) ; port nRST
NetC43_2: U5.2(GPB5) ; port EXP_GP13
NetD2_A: U5.18(GPA1) ; port EXP_GP1
NetD3_A: U5.21(GPA4) ; port EXP_GP4
NetD5_A: U5.27(GPB2) ; port EXP_GP10
NetP6_6: U4.33(GPIO21) ; port GPIO21
NetP6_7: U4.36(GPIO22) ; port GPIO22
NetP6_8: U5.17(GPA0) ; port EXP_GP0
NetQ1_G: U5.4(GPB7) ; port EXP_GP15
NetQ2_G: U5.20(GPA3) ; port EXP_GP3
NetQ4_G: U5.22(GPA5) ; port EXP_GP5
NetQ5_D: Q5.D Q6.G U9.14(4B1)
NetQ5_G: Q5.G Q6.D U9.11(3B1)
NetQ15_G: U5.3(GPB6) ; port EXP_GP14
NetR2_1: U4.11(GPIO26) ; port GPIO26
NetR3_1: U4.7(GPIO35) ; port GPI35
NetR18_1: U5.24(GPA7) ; port EXP_GP7
NetR25_1: R25.1 U9.15(~{OE})
NetR26_1: R26.1 U4.12(GPIO27) U9.1(S) ; port GPIO27, port nPROG_EN
NetR32_2: U4.28(GPIO17) ; port GPIO17
NetR34_2: U4.27(GPIO16) ; port GPIO16
NetR41_2: U5.1(GPB4) ; port EXP_GP12
NetSW2_1: U5.25(GPB0) ; port EXP_GP8
NetSW3_1: U5.26(GPB1) ; port EXP_GP9
NetSW4_1: U5.23(GPA6) ; port EXP_GP6
NetSW5_1: U5.19(GPA2) ; port EXP_GP2
NetU3_12: U4.26(GPIO4) ; port GPIO4
NetU3_13: U4.24(GPIO2) ; port GPIO2
NetU3_14: U4.13(GPIO14) ; port GPIO14
NetU3_16: U4.23(GPIO15) ; port GPIO15
NetU3_17: U4.16(GPIO13) ; port GPIO13
NetU3_18: U4.14(GPIO12) ; port GPIO12
NetU4_4: U4.4(GPI36/SENSOR_VP) U5.16(~{INTA}) ; port GPI36, port EXP_nINTA
NetU4_6: U4.6(GPIO34) ; port GPI34
NetU4_8: U4.8(GPIO32/XTAL_32K_P) ; port GPI32
NetU4_9: U4.9(GPIO33/XTAL_32K_N) ; port GPI33
NetU4_29: U4.29(GPIO5) U5.7(~{CS}) ; port GPIO5, port EXP_nCS
NetU4_34: U4.34(RXD0) U9.2(1B1) U9.3(1B2)
NetU4_35: U4.35(TXD0) U9.5(2B1) U9.6(2B2)
NetU5_28: U5.28(GPB3) ; port EXP_GP11
NetU6_1: U8.12(USBDM) ; port USBDM
NetU6_2: U8.11(USBDP) ; port USBDP
NetU8_1: U8.1(DTR#) U9.12(4A)
NetU8_2: U8.2(RTS#) U9.9(3A)
NetU8_4: U8.4(RXD) U9.7(2A)
NetU8_20: U8.20(TXD) U9.4(1A)

Not connected (* = marked no-connect by the designer): U4 17(GPIO9/SD2) 18(GPIO10/SD3) 19(GPIO11/CMD) 20(GPIO6/CLK) 21(GPIO7/SD0) 22(GPIO8/SD1) 32(NC); U5 15(~{INTB}); U8 5(RI#) 7(DSR#) 8(DCD#) 9(CTS#) 10(CBUS2) 17(CBUS1) 18(CBUS0) 19(CBUS3); U9 10(3B2) 13(4B2)

### Notes on the sheet
- ESP32: GPIO
- IO expanders
- Use Open-drain config for interrupt
- FTDI
- ESP32: reserved pins
- USB-UART powered from VUSB
- And disconnect RTS, DTR, RXD and TXD when VUSB not present
- Sheet name
- Project name
- Contact
- Rev
- Date
- Sheet
- of
- (in symbol SN74CBT3257CRGYR) S=0; S=1

### Library data of the parts
C4 C22 = Capacitor: Mfg: Murata; Mfg_PN: GRM188R60J106ME47D; HelpURL: *; NI: *; Supplier1: Digikey; Supplier1_PN: 490-3896-1-ND; Tolerance: *; Type: *; Rating: *
C6 = Capacitor: Mfg: Kemet; Mfg_PN: C0603C104Z4VACTU; HelpURL: *; NI: *; Supplier1: Digikey; Supplier1_PN: 399-1098-1-ND; Tolerance: *; Type: *; Rating: *
Q5 Q6 = MOSFET_N_GDS: NMOS; Mfg: Toshiba; HelpURL: *; NI: *; Rating: *; Supplier1: Digikey; Supplier1_PN: SSM3K56MFVL3FCT-ND; Tolerance: *; Type: *; Value: *
R10 = Resistor: Mfg: Yageo; Mfg_PN: RC0402FR-0710KL; HelpURL: *; NI: *; Supplier1: Digikey; Supplier1_PN: 311-10.0KLRCT-ND; Type: *; Rating: *; Tolerance: *
R25 R26 = Resistor: Mfg: Yageo; Mfg_PN: RC0402JR-07100KL; HelpURL: *; NI: *; Supplier1: Digikey; Supplier1_PN: 311-100KJRCT-ND; Type: *; Rating: *; Tolerance: *
U4 = ESP-WROOM-32: ESP32 MCU module with antenna; Mfg: Adafruit; HelpURL: *; NI: *; Rating: *; Supplier1: Digikey; Supplier1_PN: 1528-1801-ND; Tolerance: *; Type: *; Value: *
U5 = MCP23S17-E/ML: 16-Bit SPI I/O Expander; Mfg: Adafruit; Mfg_PN: 3320; Supplier1: Digikey; Supplier1_PN: 1528-1801-ND
U8 = FT231XS-R: USB to serial converter; Mfg: FTDI; HelpURL: *; Mfg_PN: FT231XS-R; NI: *; Rating: *; Supplier1: Digikey; Supplier1_PN: 768-1129-1-ND; Tolerance: *; Type: *; Value: *
U9 = SN74CBT3257CRGYR: Quad 1-of-2 FET switch; Mfg: Texas Instruments; HelpURL: http://www.ti.com/lit/ds/symlink/sn74cbt3257c.pdf; NI: *; Rating: *; Supplier1: Digikey; Supplier1_PN: 296-19212-1-ND; Tolerance: *; Type: *; Value: *; Mfg_PN: SN74CBT3257CRGYR

## Sheet Power.SchDoc
size Tabloid; DrawnBy: V-P.Rheaume@USherbrooke.ca; Organization: Universite de Sherbrooke; Address1: L3, 12a Rodborough Rd; Address2: Frenchs Forest; Address3: NSW; Address4: Australia 2086; Revision: 0; SheetNumber: 2; SheetTotal: 8; SheetName: Battery management
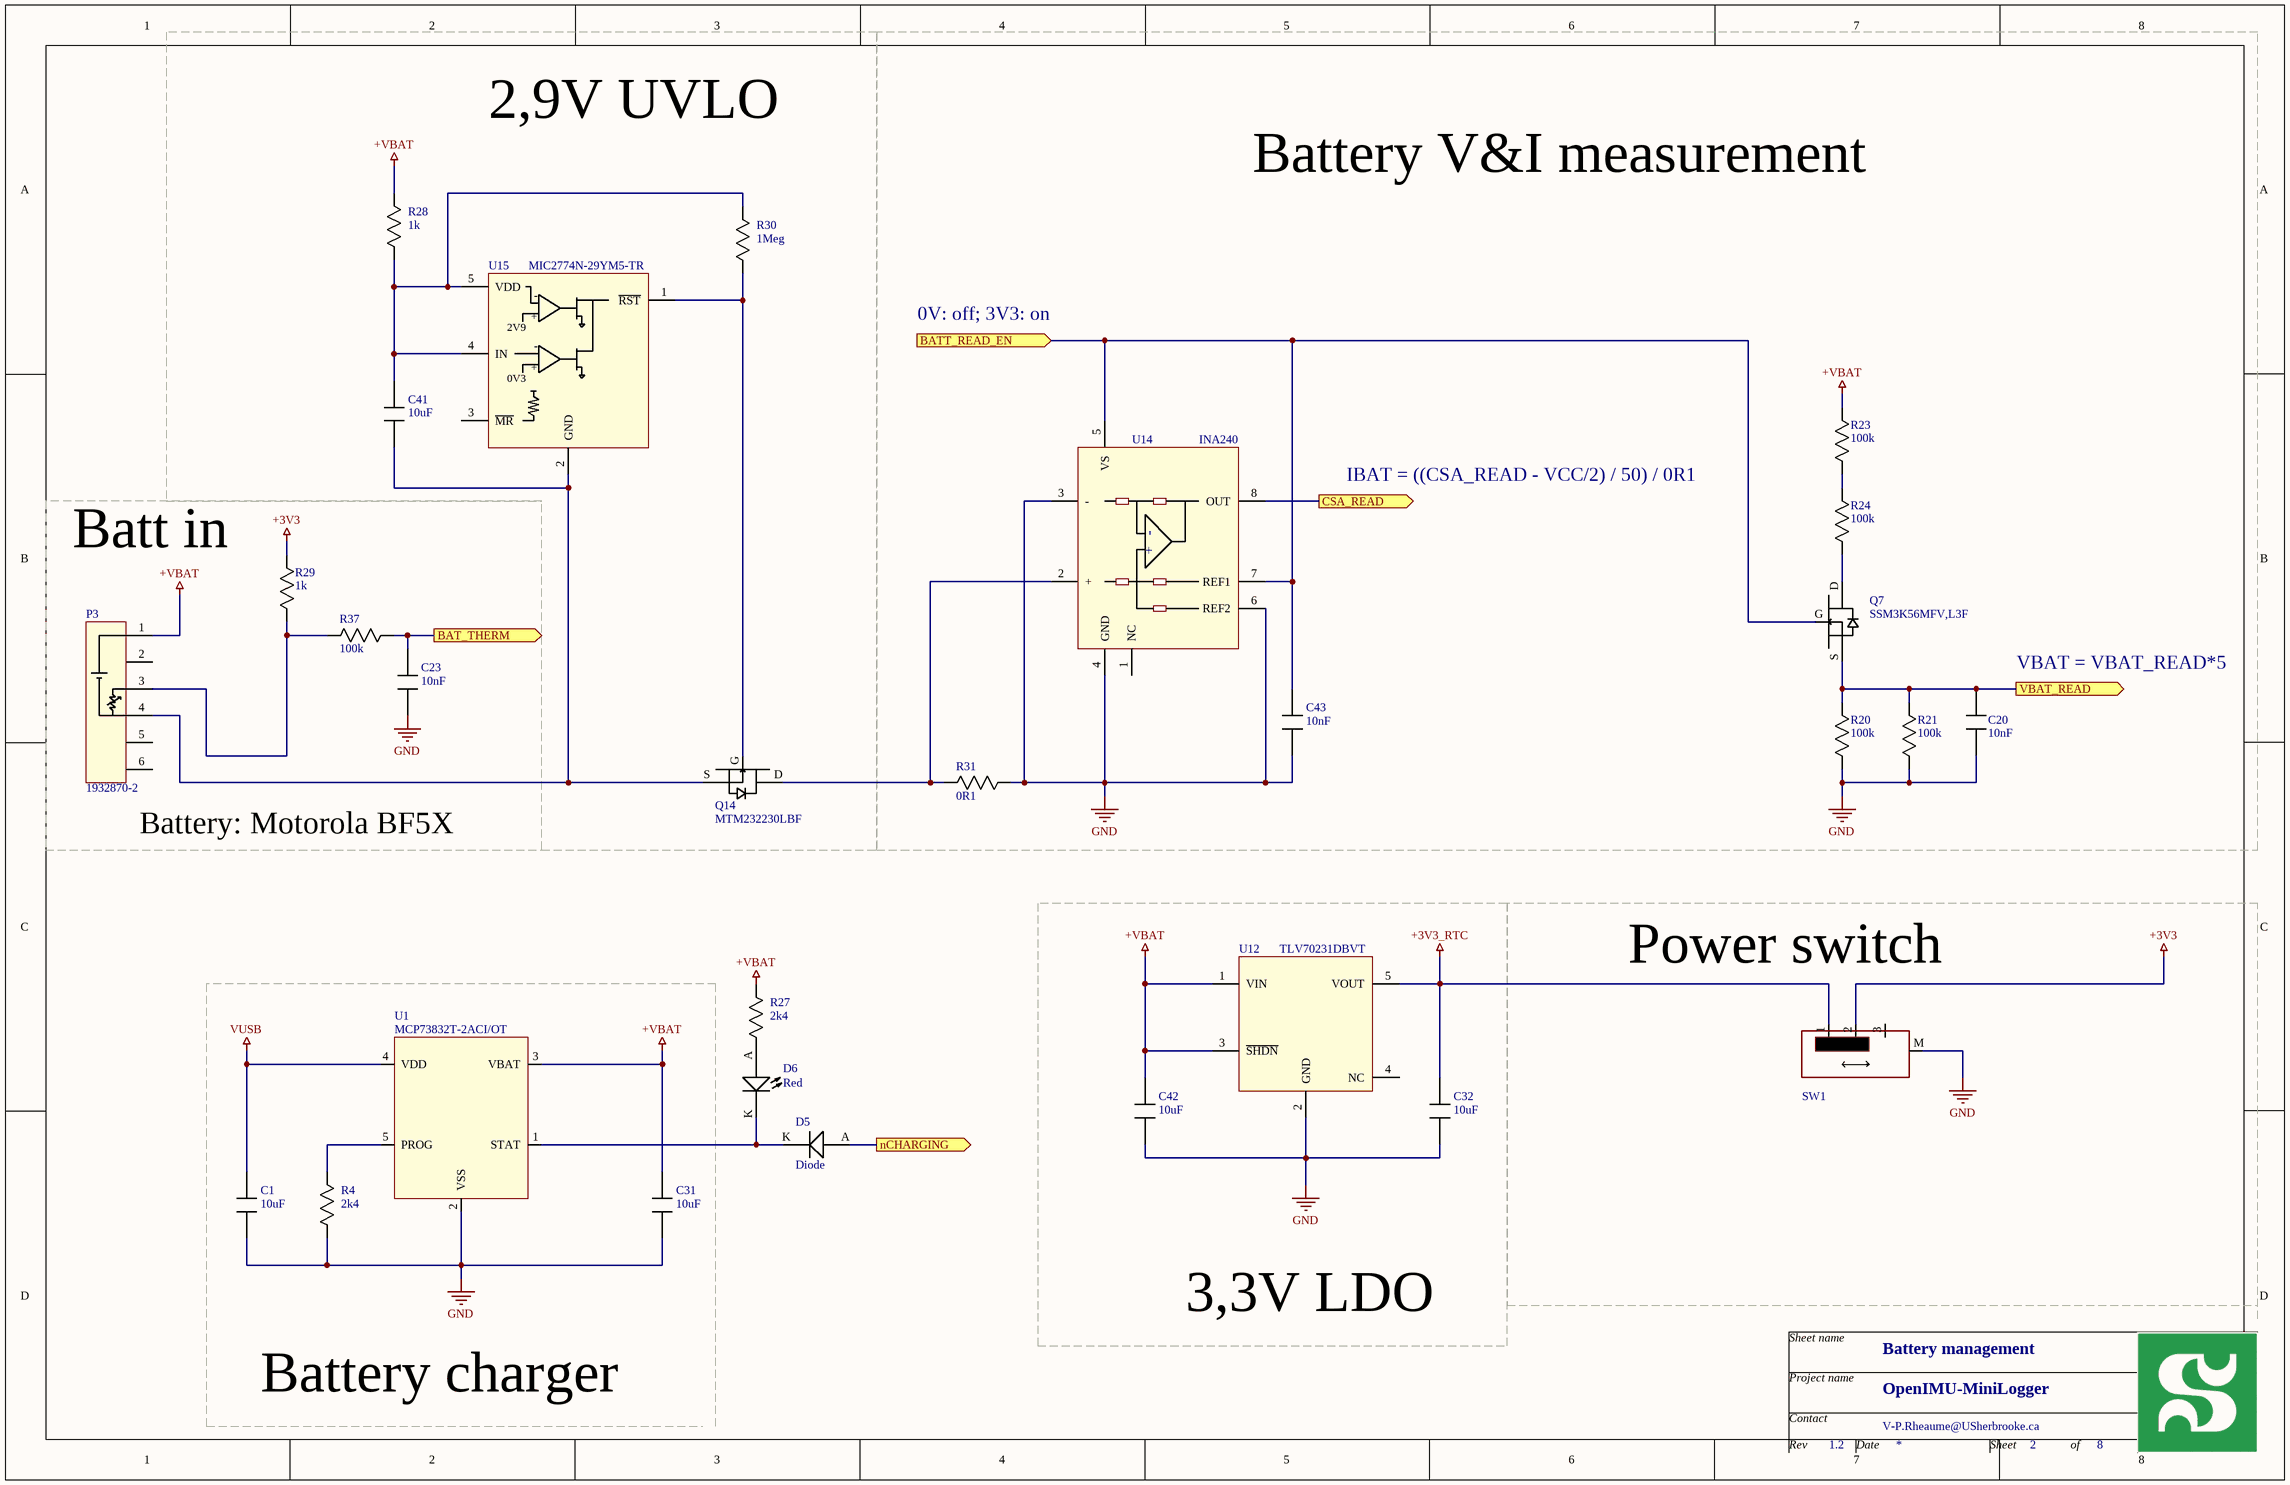
[diagram p4: Power.SchDoc]

### Parts
C1  value 10uF  [0603]  (hidden comment: Capacitor)
C20  value 10nF  [0603]  (hidden comment: Capacitor)
C23  value 10nF  [0603]  (hidden comment: Capacitor)
C31  value 10uF  [0603]  (hidden comment: Capacitor)
C32  value 10uF  [0603]  (hidden comment: Capacitor)
C41  value 10uF  [0603]  (hidden comment: Capacitor)
C42  value 10uF  [0603]  (hidden comment: Capacitor)
C43  value 10nF  [0603]  (hidden comment: Capacitor)
D5  Diode  [DIODE_SOD523]
D6  value Red  [0805_LED]  (hidden comment: Diode_LED)
P3  Mfg_PN: 1932870-2  [CONN6_FBIS2_V]  (hidden comment: CON6_FBIS2)
Q7  Mfg_PN: SSM3K56MFV,L3F  [SOT723]  (hidden comment: MOSFET_N_GDS)
Q14  Mfg_PN: MTM232230LBF  [SC70_GDS]  (hidden comment: MOSFET_N_GDS)
R4  value 2k4  [0402]  (hidden comment: Resistor)
R20  value 100k  [0402]  (hidden comment: Resistor)
R21  value 100k  [0402]  (hidden comment: Resistor)
R23  value 100k  [0402]  (hidden comment: Resistor)
R24  value 100k  [0402]  (hidden comment: Resistor)
R27  value 2k4  [0402]  (hidden comment: Resistor)
R28  value 1k  [0603]  (hidden comment: Resistor)
R29  value 1k  [0402]  (hidden comment: Resistor)
R30  value 1Meg  [0603]  (hidden comment: Resistor)
R31  value 0R1  [0603]  (hidden comment: Resistor)
R37  value 100k  [0402]  (hidden comment: Resistor)
SW1  Button_Slideswitch_MLL1200S  [SWITCH_ MLL1200S]  (value not drawn)
U1  Mfg_PN: MCP73832T-2ACI/OT  [SOT23_5]  (hidden comment: MCP73831T-2ACI/OT)
U12  Mfg_PN: TLV70231DBVT  [SOT23_5]  (hidden comment: AP2112K-3.3TRG1)
U14  INA240  [TSSOP8]
U15  MIC2774N-29YM5-TR  [SOT23_5]

### Blocks framed on the sheet
Battery V&I measurement: C20 C43 Q7 R20 R21 R23 R24 R31 U14
Batt in: C23 P3 R29 R37
3,3V LDO: C32 C42 U12

### Ports
BAT_THERM (out), BATT_READ_EN (in), CSA_READ (out), nCHARGING (out), VBAT_READ (out)

### Nets
+3V3: R29.2 SW1.2
+3V3_RTC: C32.2 SW1.1 U12.5(VOUT)
+VBAT: C31.2 C42.2 P3.1 R23.2 R27.1 R28.1 U1.3(VBAT) U12.1(VIN) U12.3(~{SHDN})
GND: C1.1 C20.1 C23.1 C31.1 C32.1 C42.1 C43.1 R4.2 R20.1 R21.1 R31.2 SW1.M U1.2(VSS) U12.2(GND) U14.3(-) U14.4(GND) U14.6(REF2)
VUSB: C1.2 U1.4(VDD)
NetC20_2: C20.2 Q7.S R20.2 R21.2 ; port VBAT_READ
NetC23_2: C23.2 R37.1 ; port BAT_THERM
NetC41_1: C41.1 P3.4(-) Q14.S U15.2(GND)
NetC41_2: C41.2 R28.2 R30.1 U15.4(IN) U15.5(VDD)
NetC43_2: C43.2 Q7.G U14.5(VS) U14.7(REF1) ; port BATT_READ_EN
NetD5_A: D5.A ; port nCHARGING
NetD5_K: D5.K D6.K U1.1(STAT)
NetD6_A: D6.A R27.2
NetP3_3: P3.3 R29.1 R37.2
NetQ7_D: Q7.D R24.1
NetQ14_D: Q14.D R31.1 U14.2(+)
NetQ14_G: Q14.G R30.2 U15.1(~{RST})
NetR4_1: R4.1 U1.5(PROG)
NetR23_1: R23.1 R24.2
NetU13_5: U14.8(OUT) ; port CSA_READ

Not connected (* = marked no-connect by the designer): P3 2 5 6; SW1 3; U12 4(NC); U14 1(NC); U15 3(~{MR})

### Notes on the sheet
- 2,9V UVLO
- 0V: off; 3V3: on
- IBAT = ((CSA_READ - VCC/2) / 50) / 0R1
- VBAT = VBAT_READ*5
- (near P3) Battery: Motorola BF5X
- Power switch
- Battery charger
- Sheet name
- Project name
- Contact
- Rev
- Date
- Sheet
- of
- (in symbol MIC2774N-29YM5-TR) -; +; 2V9; 0V3

### Library data of the parts
C1 C31 C32 C41 C42 = Capacitor: Mfg: Murata; Mfg_PN: GRM188R60J106ME47D; HelpURL: *; NI: *; Supplier1: Digikey; Supplier1_PN: 490-3896-1-ND; Tolerance: *; Type: *; Rating: *
C20 C23 C43 = Capacitor: Mfg: Wurth; Mfg_PN: 885012206040; HelpURL: *; NI: *; Supplier1: Digikey; Supplier1_PN: 732-7959-1-ND; Tolerance: *; Type: *; Rating: *
D5 = Diode: Mfg: MCC; Mfg_PN: 1N4148X-TP; HelpURL: *; NI: *; Supplier1: Digikey; Supplier1_PN: 1N4148XTPMSCT-ND; Tolerance: *; Type: *; Rating: *; Value: *
D6 = Diode_LED: LED; Mfg: Wurth; Mfg_PN: 150080RS75000; HelpURL: *; NI: *; Supplier1: Digikey; Supplier1_PN: 732-4984-1-ND; Tolerance: *; Type: *; Rating: *
P3 = CON6_FBIS2: 6-pins for Motorola?; Mfg: TE; HelpURL: *; NI: *; Rating: *; Supplier1: Digikey; Supplier1_PN: A117909CT-ND; Tolerance: *; Type: *; Value: *
Q7 = MOSFET_N_GDS: NMOS; Mfg: Toshiba; HelpURL: *; NI: *; Rating: *; Supplier1: Digikey; Supplier1_PN: SSM3K56MFVL3FCT-ND; Tolerance: *; Type: *; Value: *
Q14 = MOSFET_N_GDS: NMOS; Mfg: Panasonic; HelpURL: *; NI: *; Rating: *; Supplier1: Digikey; Supplier1_PN: MTM232230LBFCT-ND; Tolerance: *; Type: *; Value: *
R4 R27 = Resistor: Mfg: Yageo; Mfg_PN: RC0402JR-072K4L; HelpURL: *; NI: *; Supplier1: Digikey; Supplier1_PN: 311-2.4KJRCT-ND; Type: *; Rating: *; Tolerance: *
R20 R21 R23 R24 R37 = Resistor: Mfg: Yageo; Mfg_PN: RC0402JR-07100KL; HelpURL: *; NI: *; Supplier1: Digikey; Supplier1_PN: 311-100KJRCT-ND; Type: *; Rating: *; Tolerance: *
R28 = Resistor: Mfg: Yageo; Mfg_PN: RC0603JR-071KL; HelpURL: *; NI: *; Supplier1: Digikey; Supplier1_PN: 311-1.0KGRCT-ND; Type: *; Rating: *; Tolerance: *
R29 = Resistor: Mfg: TE; Mfg_PN: CRG0402J1K0; HelpURL: *; NI: *; Supplier1: Digikey; Supplier1_PN: A106129CT-ND; Type: *; Rating: *; Tolerance: *
R30 = Resistor: Mfg: Stackpole; Mfg_PN: RMCF0603JG1M00; HelpURL: *; NI: *; Supplier1: Digikey; Supplier1_PN: RMCF0603JG1M00CT-ND; Type: *; Rating: *; Tolerance: *
R31 = Resistor: Mfg: TE; Mfg_PN: RL73N1JR10JTD; HelpURL: *; NI: *; Supplier1: Digikey; Supplier1_PN: A103277CT-ND; Type: *; Rating: *; Tolerance: *
SW1 = Button_Slideswitch_MLL1200S: Slide switch; Mfg: TE; HelpURL: *; Mfg_PN: MLL1200S; NI: *; Rating: *; Tolerance: *; Value: *; Supplier1: Digikey; Supplier1_PN: 450-1577-ND
U1 = MCP73831T-2ACI/OT: Lithium Ion Battery charger, linear; Mfg: Microchip; HelpURL: *; NI: *; Supplier1: Digikey; Supplier1_PN: MCP73832T-2ACI/OTCT-ND; Type: *
U12 = AP2112K-3.3TRG1: Linear voltage regulator; Mfg: TI; HelpURL: *; NI: *; Supplier1: Digikey; Supplier1_PN: 296-27894-1-ND; Type: *
U14 = INA240: High/low-side bidirectional current sense with enhanced PWM rejection; fixed-gain, 20, 50, 100 or 200; Mfg: Texas Instruments; Mfg_PN: INA240A2PW; HelpURL: *; NI: *; Rating: *; Supplier1: Digikey; Supplier1_PN: 296-47187-ND; Tolerance: *; Value: *
U15 = MIC2774N-29YM5-TR: Voltage supervisor and power-on timer, dual; Mfg: Micrel; HelpURL: *; Mfg_PN: MIC2774N-29YM5-TR; NI: *; Rating: *; Supplier1: Digikey; Supplier1_PN: 576-1101-1-ND; Tolerance: *; Type: *; Value: *

## Sheet Sensors.SchDoc
size Tabloid; DrawnBy: V-P.Rheaume@USherbrooke.ca; Organization: Universite de Sherbrooke; Address1: L3, 12a Rodborough Rd; Address2: Frenchs Forest; Address3: NSW; Address4: Australia 2086; Revision: 0; SheetNumber: 7; SheetTotal: 8; SheetName: Sensors
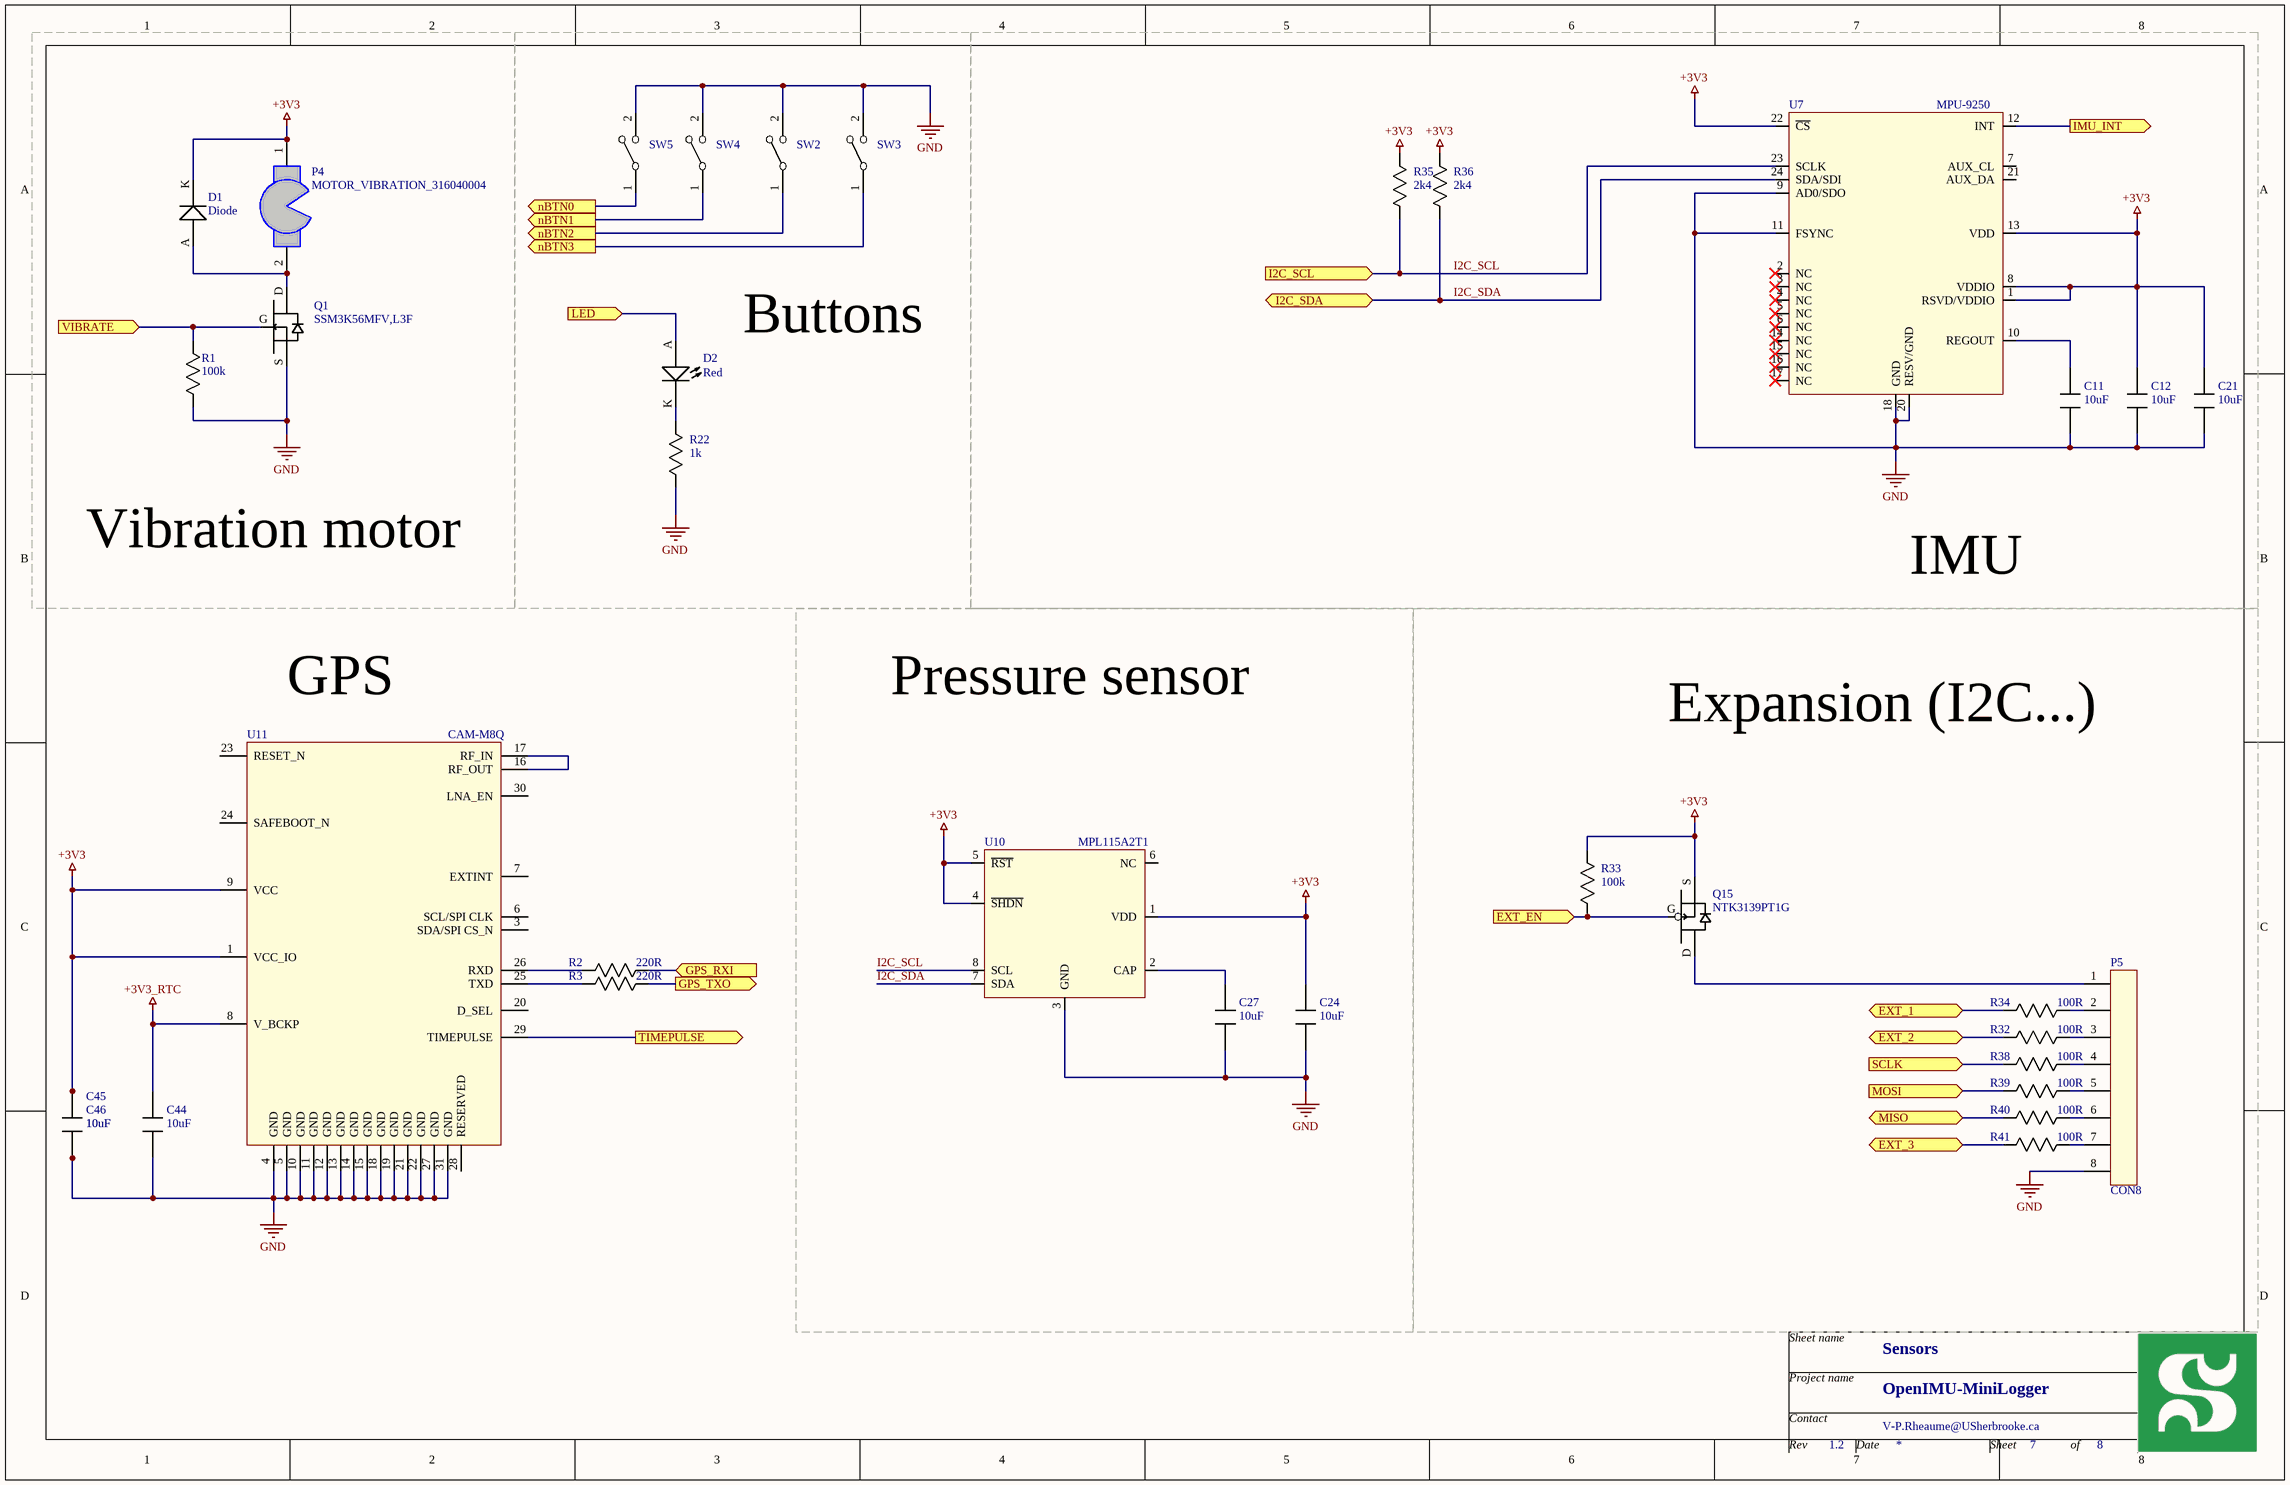
[diagram p5: Sensors.SchDoc]

### Parts
C11  value 10uF  [0603]  (hidden comment: Capacitor)
C12  value 10uF  [0603]  (hidden comment: Capacitor)
C21  value 10uF  [0603]  (hidden comment: Capacitor)
C24  value 10uF  [0603]  (hidden comment: Capacitor)
C27  value 10uF  [0603]  (hidden comment: Capacitor)
C44  value 10uF  [0603]  (hidden comment: Capacitor)
C45  value 10uF  [0603]  (hidden comment: Capacitor)
C46  value 10uF  [0603]  (hidden comment: Capacitor)
D1  Diode  [DIODE_SOD523]
D2  value Red  [0805_LED]  (hidden comment: Diode_LED)
P4  MOTOR_VIBRATION_316040004  [MOTOR_VIBRATION_316040004]
P5  CON8  [CONN8_JSTSH]
Q1  Mfg_PN: SSM3K56MFV,L3F  [SOT723]  (hidden comment: MOSFET_N_GDS)
Q15  Mfg_PN: NTK3139PT1G  [SOT723]  (hidden comment: MOSFET_P_GDS)
R1  value 100k  [0402]  (hidden comment: Resistor)
R2  value 220R  [0805]  (hidden comment: Resistor)
R3  value 220R  [0805]  (hidden comment: Resistor)
R22  value 1k  [0402]  (hidden comment: Resistor)
R32  value 100R  [0402]  (hidden comment: Resistor)
R33  value 100k  [0402]  (hidden comment: Resistor)
R34  value 100R  [0402]  (hidden comment: Resistor)
R35  value 2k4  [0402]  (hidden comment: Resistor)
R36  value 2k4  [0402]  (hidden comment: Resistor)
R38  value 100R  [0402]  (hidden comment: Resistor)
R39  value 100R  [0402]  (hidden comment: Resistor)
R40  value 100R  [0402]  (hidden comment: Resistor)
R41  value 100R  [0402]  (hidden comment: Resistor)
SW2  Button_2pins  [BUTTON_EVP-AW]  (value not drawn)
SW3  Button_2pins  [BUTTON_EVP-AW]  (value not drawn)
SW4  Button_2pins  [BUTTON_EVP-AW]  (value not drawn)
SW5  Button_2pins  [BUTTON_EVP-AW]  (value not drawn)
U7  MPU-9250  [QFN24-0.4mm-NOPAD]
U10  MPL115A2T1  [MPL115A2T1]
U11  CAM-M8Q  [CAM-M8]

### Blocks framed on the sheet
Vibration motor: D1 P4 Q1 R1
IMU: C11 C12 C21 R35 R36 U7
Pressure sensor: C24 C27 U10
Expansion (I2C...): P5 Q15 R32-R34 R38-R41

### Ports
EXT_1 (bidir), EXT_2 (bidir), EXT_3 (bidir), EXT_EN (in), GPS_RXI (in), GPS_TXO (out), I2C_SCL (in), I2C_SDA (bidir), IMU_INT (out), LED (in), MISO (bidir), MOSI (in), nBTN0 (out), nBTN1 (out), nBTN2 (out), nBTN3 (out), SCLK (in), TIMEPULSE (out), VIBRATE (in)

### Nets
+3V3: C12.1 C21.1 C24.1 C45.1 C46.1 D1.K P4.1 Q15.S R33.2 R35.1 R36.1 U7.1(RSVD/VDDIO) U7.8(VDDIO) U7.13(VDD) U7.22(~{CS}) U10.1(VDD) U10.4(~{SHDN}) U10.5(~{RST}) U11.1(VCC_IO) U11.9(VCC)
+3V3_RTC: C44.1 U11.8(V_BCKP)
GND: C11.2 C12.2 C21.2 C24.2 C27.2 C44.2 C45.2 C46.2 P5.8 Q1.S R1.2 R22.1 SW2.2 SW3.2 SW4.2 SW5.2 U7.9(AD0/SDO) U7.11(FSYNC) U7.18(GND) U7.20(RESV/GND) U10.3(GND) U11.4(GND) U11.5(GND) U11.10(GND) U11.11(GND) U11.12(GND) U11.13(GND) U11.14(GND) U11.15(GND) U11.18(GND) U11.19(GND) U11.21(GND) U11.22(GND) U11.27(GND) U11.31(GND)
I2C_SCL: R35.2 U7.23(SCLK) U10.8(SCL) ; port I2C_SCL
I2C_SDA: R36.2 U7.24(SDA/SDI) U10.7(SDA) ; port I2C_SDA
MISO: R40.2 ; port MISO
MOSI: R39.2 ; port MOSI
SCLK: R38.2 ; port SCLK
NetC11_1: C11.1 U7.10(REGOUT)
NetC27_1: C27.1 U10.2(CAP)
NetD1_A: D1.A P4.2 Q1.D
NetD2_A: D2.A ; port LED
NetD2_K: D2.K R22.2
NetP5_1: P5.1 Q15.D
NetP5_2: P5.2 R34.1
NetP5_3: P5.3 R32.1
NetP5_4: P5.4 R38.1
NetP5_5: P5.5 R39.1
NetP5_6: P5.6 R40.1
NetP5_7: P5.7 R41.1
NetQ1_G: Q1.G R1.1 ; port VIBRATE
NetQ15_G: Q15.G R33.1 ; port EXT_EN
NetR2_1: R2.1 ; port GPS_RXI
NetR2_2: R2.2 U11.26(RXD)
NetR3_1: R3.1 ; port GPS_TXO
NetR3_2: R3.2 U11.25(TXD)
NetR32_2: R32.2 ; port EXT_2
NetR34_2: R34.2 ; port EXT_1
NetR41_2: R41.2 ; port EXT_3
NetSW2_1: SW2.1 ; port nBTN2
NetSW3_1: SW3.1 ; port nBTN3
NetSW4_1: SW4.1 ; port nBTN1
NetSW5_1: SW5.1 ; port nBTN0
NetU4_6: U7.12(INT) ; port IMU_INT
NetU4_8: U11.29(TIMEPULSE) ; port TIMEPULSE
NetU11_16: U11.16(RF_OUT) U11.17(RF_IN)

Not connected (* = marked no-connect by the designer): U7 2(NC)* 3(NC)* 4(NC)* 5(NC)* 6(NC)* 7(AUX_CL) 14(NC)* 15(NC)* 16(NC)* 17(NC)* 19(RESV/NC) 21(AUX_DA); U10 6(NC); U11 2(RESERVED) 3(SDA/SPI_CS_N) 6(SCL/SPI_CLK) 7(EXTINT) 20(D_SEL) 23(RESET_N) 24(SAFEBOOT_N) 28(RESERVED) 30(LNA_EN)

### Notes on the sheet
- Buttons
- (near U11) GPS
- Sheet name
- Project name
- Contact
- Rev
- Date
- Sheet
- of

### Library data of the parts
C11 C12 C21 C24 C27 C44-C46 = Capacitor: Mfg: Murata; Mfg_PN: GRM188R60J106ME47D; HelpURL: *; NI: *; Supplier1: Digikey; Supplier1_PN: 490-3896-1-ND; Tolerance: *; Type: *; Rating: *
D1 = Diode: Mfg: MCC; Mfg_PN: 1N4148X-TP; HelpURL: *; NI: *; Supplier1: Digikey; Supplier1_PN: 1N4148XTPMSCT-ND; Tolerance: *; Type: *; Rating: *; Value: *
D2 = Diode_LED: LED; Mfg: Wurth; Mfg_PN: 150080RS75000; HelpURL: *; NI: *; Supplier1: Digikey; Supplier1_PN: 732-4984-1-ND; Tolerance: *; Type: *; Rating: *
P4 = MOTOR_VIBRATION_316040004: Round, flat, 10-mm diameter, 3-mm thick vibration motor; Mfg: Seeed; HelpURL: *; Mfg_PN: 316040004; NI: *; Rating: *; Supplier1: Digikey; Supplier1_PN: 1597-1245-ND; Tolerance: *; Type: *; Value: *
P5 = CON8: 8-pins; Mfg: JST; Mfg_PN: SM08B-SRSS-TB(LF)(SN); HelpURL: *; NI: *; Rating: *; Supplier1: Digikey; Supplier1_PN: 455-1808-1-ND; Tolerance: *; Type: *; Value: *
Q1 = MOSFET_N_GDS: NMOS; Mfg: Toshiba; HelpURL: *; NI: *; Rating: *; Supplier1: Digikey; Supplier1_PN: SSM3K56MFVL3FCT-ND; Tolerance: *; Type: *; Value: *
Q15 = MOSFET_P_GDS: PMOS; Mfg: OnSemi; HelpURL: *; NI: *; Rating: *; Supplier1: Digikey; Supplier1_PN: NTK3139PT1GOSCT-ND; Tolerance: *; Type: *; Value: *
R1 R33 = Resistor: Mfg: Yageo; Mfg_PN: RC0402JR-07100KL; HelpURL: *; NI: *; Supplier1: Digikey; Supplier1_PN: 311-100KJRCT-ND; Type: *; Rating: *; Tolerance: *
R2 R3 = Resistor: Mfg: Stackpole; Mfg_PN: RMCF0805JT220R; HelpURL: *; NI: *; Supplier1: Digikey; Supplier1_PN: RMCF0805JT220RCT-ND; Type: *; Rating: *; Tolerance: *
R22 = Resistor: Mfg: TE; Mfg_PN: CRG0402J1K0; HelpURL: *; NI: *; Supplier1: Digikey; Supplier1_PN: A106129CT-ND; Type: *; Rating: *; Tolerance: *
R32 R34 R38-R41 = Resistor: Mfg: TE; Mfg_PN: CRG0402J100R/10; HelpURL: *; NI: *; Supplier1: Digikey; Supplier1_PN: A121522CT-ND; Type: *; Rating: *; Tolerance: *
R35 R36 = Resistor: Mfg: Yageo; Mfg_PN: RC0402JR-072K4L; HelpURL: *; NI: *; Supplier1: Digikey; Supplier1_PN: 311-2.4KJRCT-ND; Type: *; Rating: *; Tolerance: *
SW2-SW5 = Button_2pins: Button; Mfg: Panasonic; Mfg_PN: EVP-AWBD2A; HelpURL: *; NI: *; Rating: *; Tolerance: *; Value: *; Supplier1: Digikey; Supplier1_PN: P19743CT-ND
U7 = MPU-9250: IMU ACCEL/GYRO/MAG I2C/SPI 24QFN; Mfg: Invensense; HelpURL: *; NI: *; Rating: *; Supplier1: Digikey; Supplier1_PN: 1428-1019-1-ND; Tolerance: *; Type: *; Value: *; Mfg_PN: MPU-9250
U10 = MPL115A2T1: IC BAROMETER I2C; Mfg: NXP; HelpURL: *; Mfg_PN: MPL115A2T1; NI: *; Rating: *; Supplier1: Digikey; Supplier1_PN: MPL115A2T1CT-ND; Tolerance: *; Type: *; Value: *
U11 = CAM-M8: u-blox CAM GNSS antenna module; Mfg_PN: CAM-M8Q-0; Value: CAM-M8Q; Mfg: u-blox; Supplier1: Digikey; Supplier1_PN: 672-1013-1-ND

## Sheet Display.SchDoc
size Tabloid; DrawnBy: V-P.Rheaume@USherbrooke.ca; Organization: Universite de Sherbrooke; Address1: L3, 12a Rodborough Rd; Address2: Frenchs Forest; Address3: NSW; Address4: Australia 2086; Revision: 0; SheetNumber: 8; SheetTotal: 8; SheetName: Display
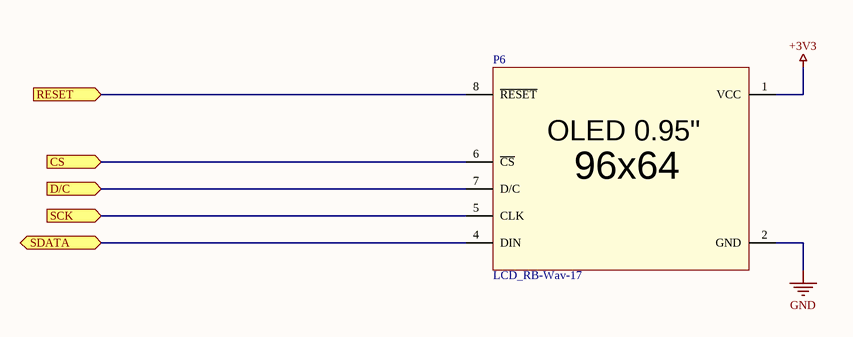
[diagram p6: Display.SchDoc]

### Parts
P6  LCD_RB-Wav-17  [LCD_RB-Wav-17]

### Ports
CS (in), D/C (in), RESET (in), SCK (in), SDATA (bidir)

### Nets
+3V3: P6.1(VCC)
GND: P6.2(GND)
MOSI: P6.4(DIN) ; port SDATA
SCLK: P6.5(CLK) ; port SCK
NetP6_6: P6.6(~{CS}) ; port CS
NetP6_7: P6.7(D/C) ; port D/C
NetP6_8: P6.8(~{RESET}) ; port RESET

Not connected (* = marked no-connect by the designer): P6 3(NC) M(NC)

### Notes on the sheet
- Sheet name
- Project name
- Contact
- Rev
- Date
- Sheet
- of
- (in symbol LCD_RB-Wav-17) OLED 0.95"; 96x64

### Library data of the parts
P6 = LCD_RB-Wav-17: 96x64 resolution 0.95inch OLED; Mfg: Waveshare; HelpURL: *; Mfg_PN: RB-Wav-17; NI: *; Rating: *; Supplier1: Robotshop; Supplier1_PN: RB-Wav-17; Tolerance: *; Type: *; Value: *

## Sheet ADC.SchDoc
size Tabloid; DrawnBy: V-P.Rheaume@USherbrooke.ca; Organization: Universite de Sherbrooke; Address1: L3, 12a Rodborough Rd; Address2: Frenchs Forest; Address3: NSW; Address4: Australia 2086; Revision: 0; SheetNumber: 6; SheetTotal: 8; SheetName: ADC
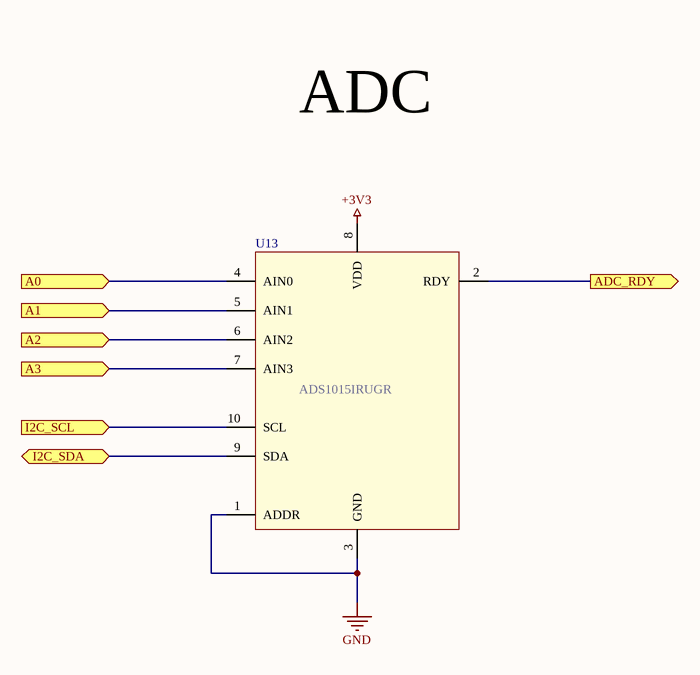
[diagram p7: ADC.SchDoc]

### Parts
U13  ADS1015IRUGR  [ADS1018IRUGR]

### Ports
A0 (in), A1 (in), A2 (in), A3 (in), ADC_RDY (out), I2C_SCL (in), I2C_SDA (bidir)

### Nets
+3V3: U13.8(VDD)
GND: U13.1(ADDR) U13.3(GND)
I2C_SCL: U13.10(SCL) ; port I2C_SCL
I2C_SDA: U13.9(SDA) ; port I2C_SDA
NetC20_2: U13.4(AIN0) ; port A0
NetC23_2: U13.6(AIN2) ; port A2
NetU4_9: U13.2(RDY) ; port ADC_RDY
NetU13_5: U13.5(AIN1) ; port A1
NetU13_7: U13.7(AIN3) ; port A3

### Notes on the sheet
- ADC
- Sheet name
- Project name
- Contact
- Rev
- Date
- Sheet
- of

### Library data of the parts
U13 = ADS1115: 16-bit ADC, 4-channel; Mfg: TI; HelpURL: http://www.ti.com/lit/ds/symlink/ads1113.pdf; Mfg_PN: ADS1015IRUGR; NI: *; Supplier1: Digikey; Supplier1_PN: 296-43557-1-ND; Type: *

## Nets that join several sheets
+3V3: SD_Share (C5.1 Q2.S R5.1 U3.15), MCU (6 pins), Power (R29.2 SW1.2), Sensors (20 pins), Display (P6.1), ADC (U13.8)
+3V3_RTC: Power (C32.2 SW1.1 U12.5), Sensors (C44.1 U11.8)
+3V3_USB: TopLevel (R18.2), USB_SD (16 pins), SD_Share (R12.1 R13.1), MCU (5 pins)
GND: USB_SD (20 pins), SD_Share (14 pins), MCU (18 pins), Power (17 pins), Sensors (35 pins), Display (P6.2), ADC (U13.1 U13.3)
VUSB: USB_SD (C2.1 P2.1 U2.1 U2.3), Power (C1.2 U1.4)
1_VDD: USB_SD (U6.35), SD_Share (C7.1 U3.22)
I2C_SCL: MCU (U4.10), Sensors (R35.2 U7.23 U10.8), ADC (U13.10)
I2C_SDA: MCU (U4.37), Sensors (R36.2 U7.24 U10.7), ADC (U13.9)
MISO: MCU (U4.5 U5.10), Sensors (R40.2)
MOSI: MCU (U4.30 U5.9), Sensors (R39.2), Display (P6.4)
NetC20_2: Power (C20.2 Q7.S R20.2 R21.2), ADC (U13.4)
NetC23_2: Power (C23.2 R37.1), ADC (U13.6)
NetC43_2: MCU (U5.2), Power (C43.2 Q7.G U14.5 U14.7)
NetD2_A: MCU (U5.18), Sensors (D2.A)
NetD3_A: SD_Share (D3.A), MCU (U5.21)
NetD4_A: USB_SD (U6.14), SD_Share (D4.A R13.2)
NetD5_A: MCU (U5.27), Power (D5.A)
NetP6_6: MCU (U4.33), Display (P6.6)
NetP6_7: MCU (U4.36), Display (P6.7)
NetP6_8: MCU (U5.17), Display (P6.8)
NetQ1_G: MCU (U5.4), Sensors (Q1.G R1.1)
NetQ2_G: SD_Share (Q2.G R5.2), MCU (U5.20)
NetQ4_G: SD_Share (Q4.G R11.2 U3.11), MCU (U5.22)
NetQ15_G: MCU (U5.3), Sensors (Q15.G R33.1)
NetR2_1: MCU (U4.11), Sensors (R2.1)
NetR3_1: MCU (U4.7), Sensors (R3.1)
NetR18_1: TopLevel (R18.1), MCU (U5.24)
NetR32_2: MCU (U4.28), Sensors (R32.2)
NetR34_2: MCU (U4.27), Sensors (R34.2)
NetR41_2: MCU (U5.1), Sensors (R41.2)
NetSW2_1: MCU (U5.25), Sensors (SW2.1)
NetSW3_1: MCU (U5.26), Sensors (SW3.1)
NetSW4_1: MCU (U5.23), Sensors (SW4.1)
NetSW5_1: MCU (U5.19), Sensors (SW5.1)
NetU3_1: USB_SD (U6.33), SD_Share (U3.1)
NetU3_12: SD_Share (U3.12), MCU (U4.26)
NetU3_13: SD_Share (U3.13), MCU (U4.24)
NetU3_14: SD_Share (U3.14), MCU (U4.13)
NetU3_16: SD_Share (U3.16), MCU (U4.23)
NetU3_17: SD_Share (U3.17), MCU (U4.16)
NetU3_18: SD_Share (U3.18), MCU (U4.14)
NetU3_19: USB_SD (U6.17), SD_Share (U3.19)
NetU3_20: USB_SD (U6.18), SD_Share (U3.20)
NetU3_21: USB_SD (U6.21), SD_Share (U3.21)
NetU3_23: USB_SD (U6.24), SD_Share (U3.23)
NetU3_24: USB_SD (U6.32), SD_Share (U3.24)
NetU4_6: MCU (U4.6), Sensors (U7.12)
NetU4_8: MCU (U4.8), Sensors (U11.29)
NetU4_9: MCU (U4.9), ADC (U13.2)
NetU6_1: USB_SD (U6.1), MCU (U8.12)
NetU6_2: USB_SD (U6.2), MCU (U8.11)
NetU13_5: Power (U14.8), ADC (U13.5)
SCLK: MCU (U4.31 U5.8), Sensors (R38.2), Display (P6.5)